# EAGLE board SPU (EAGLE 9.6.2), part 1 of 3
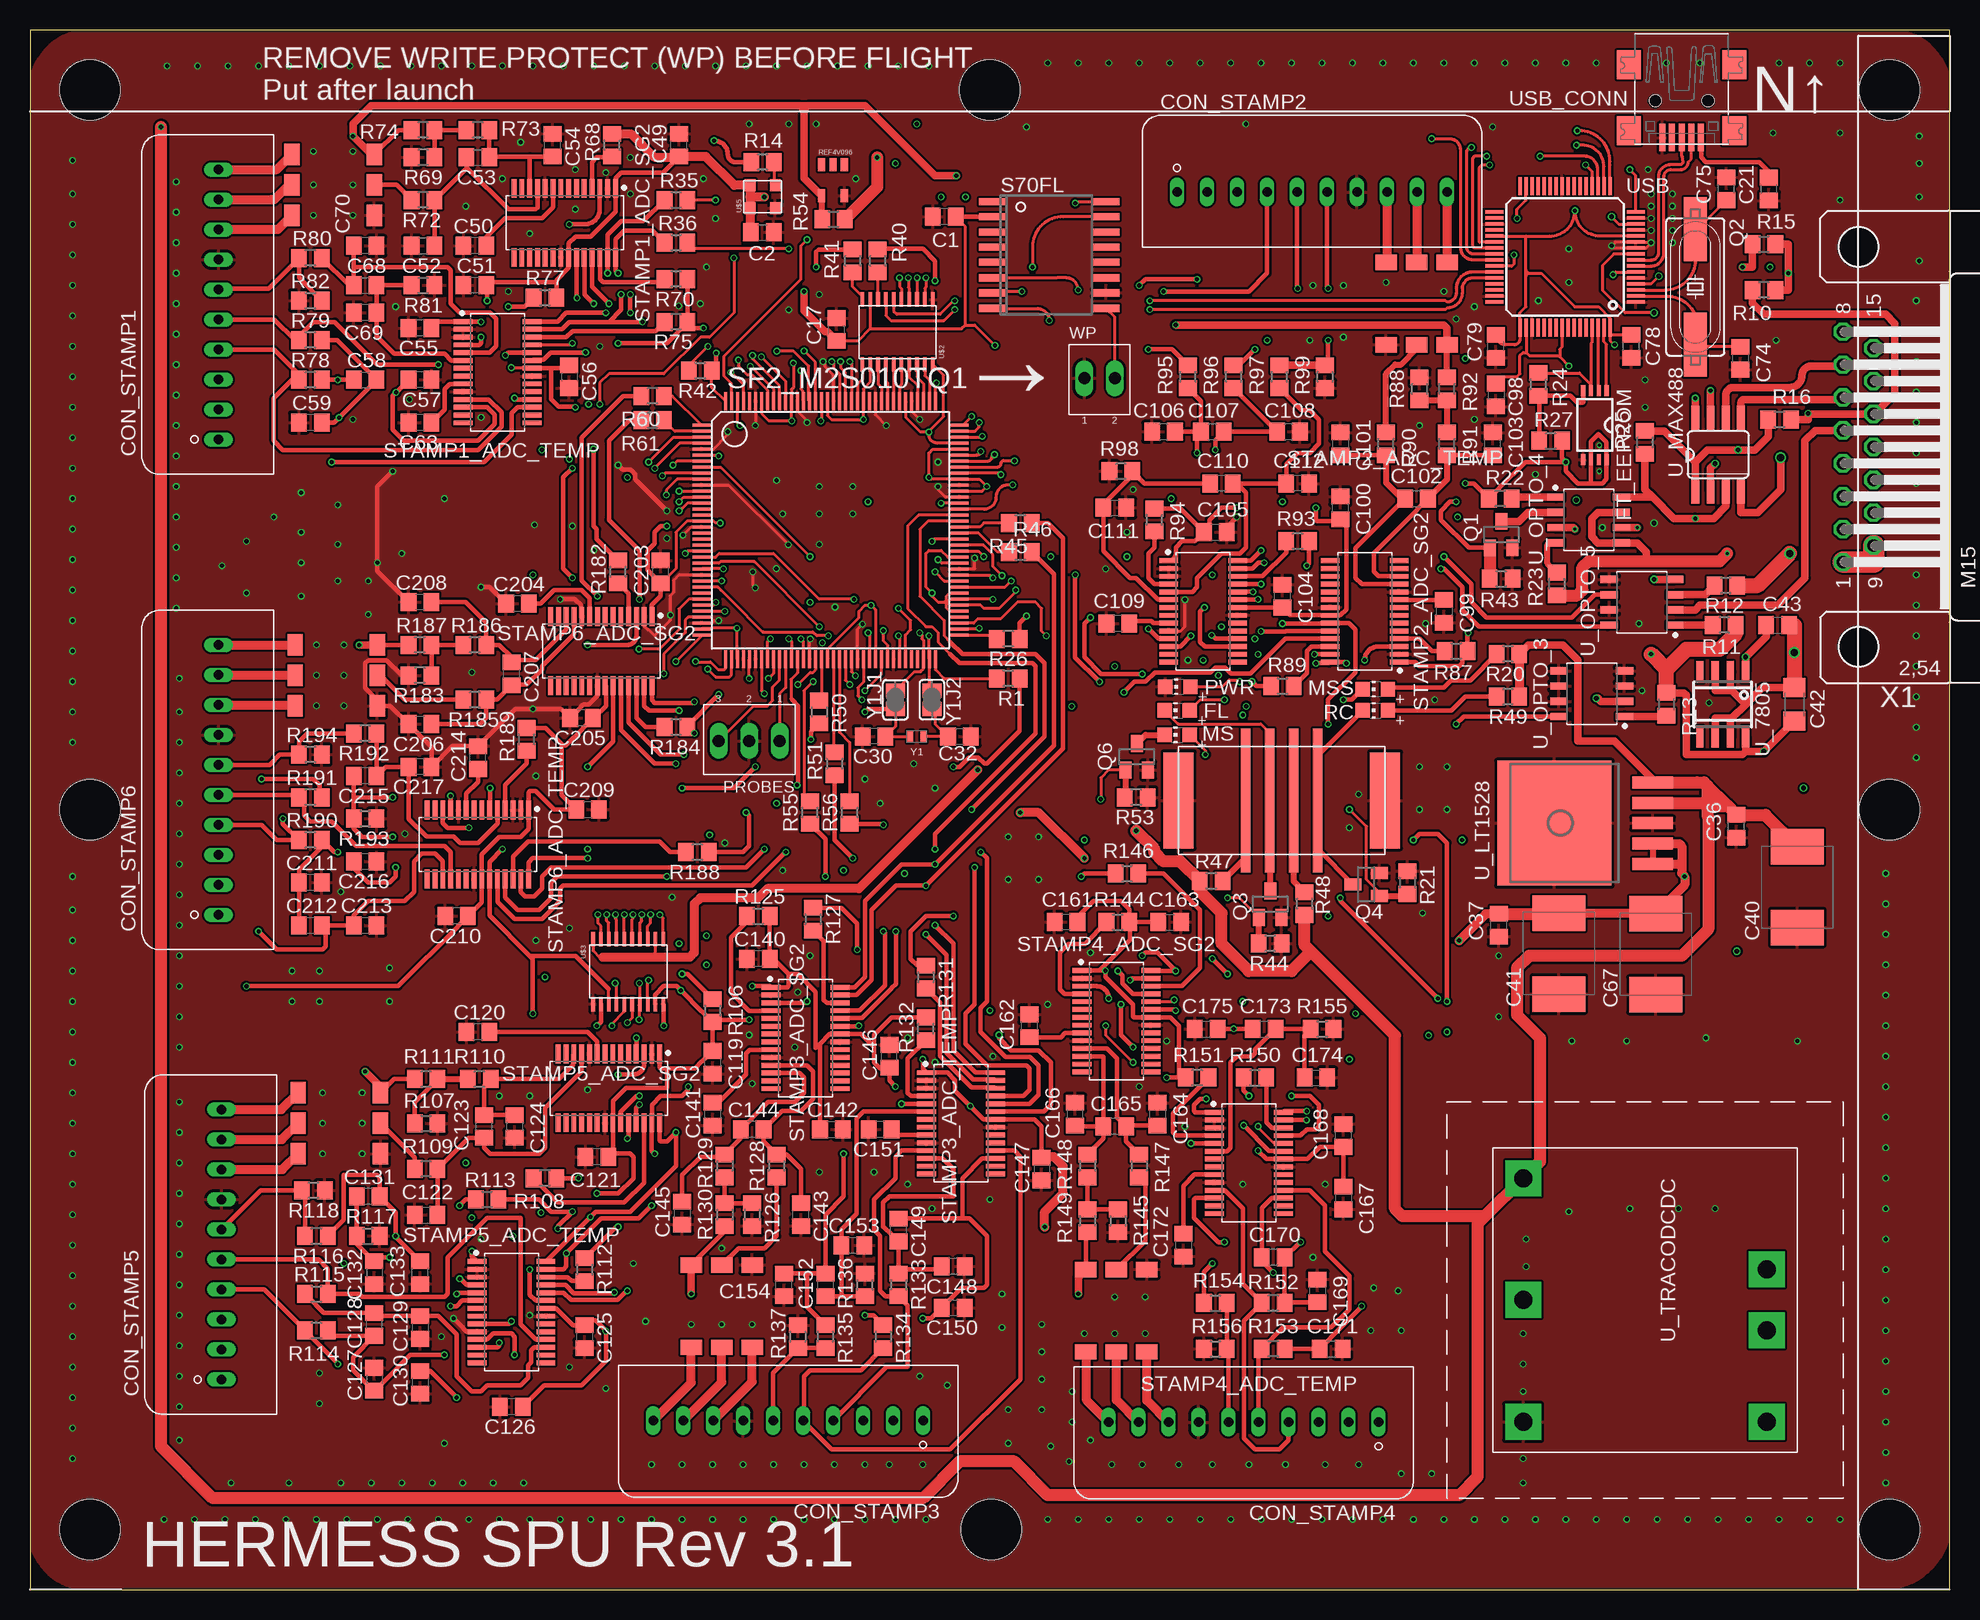
[diagram p8: board, top side]
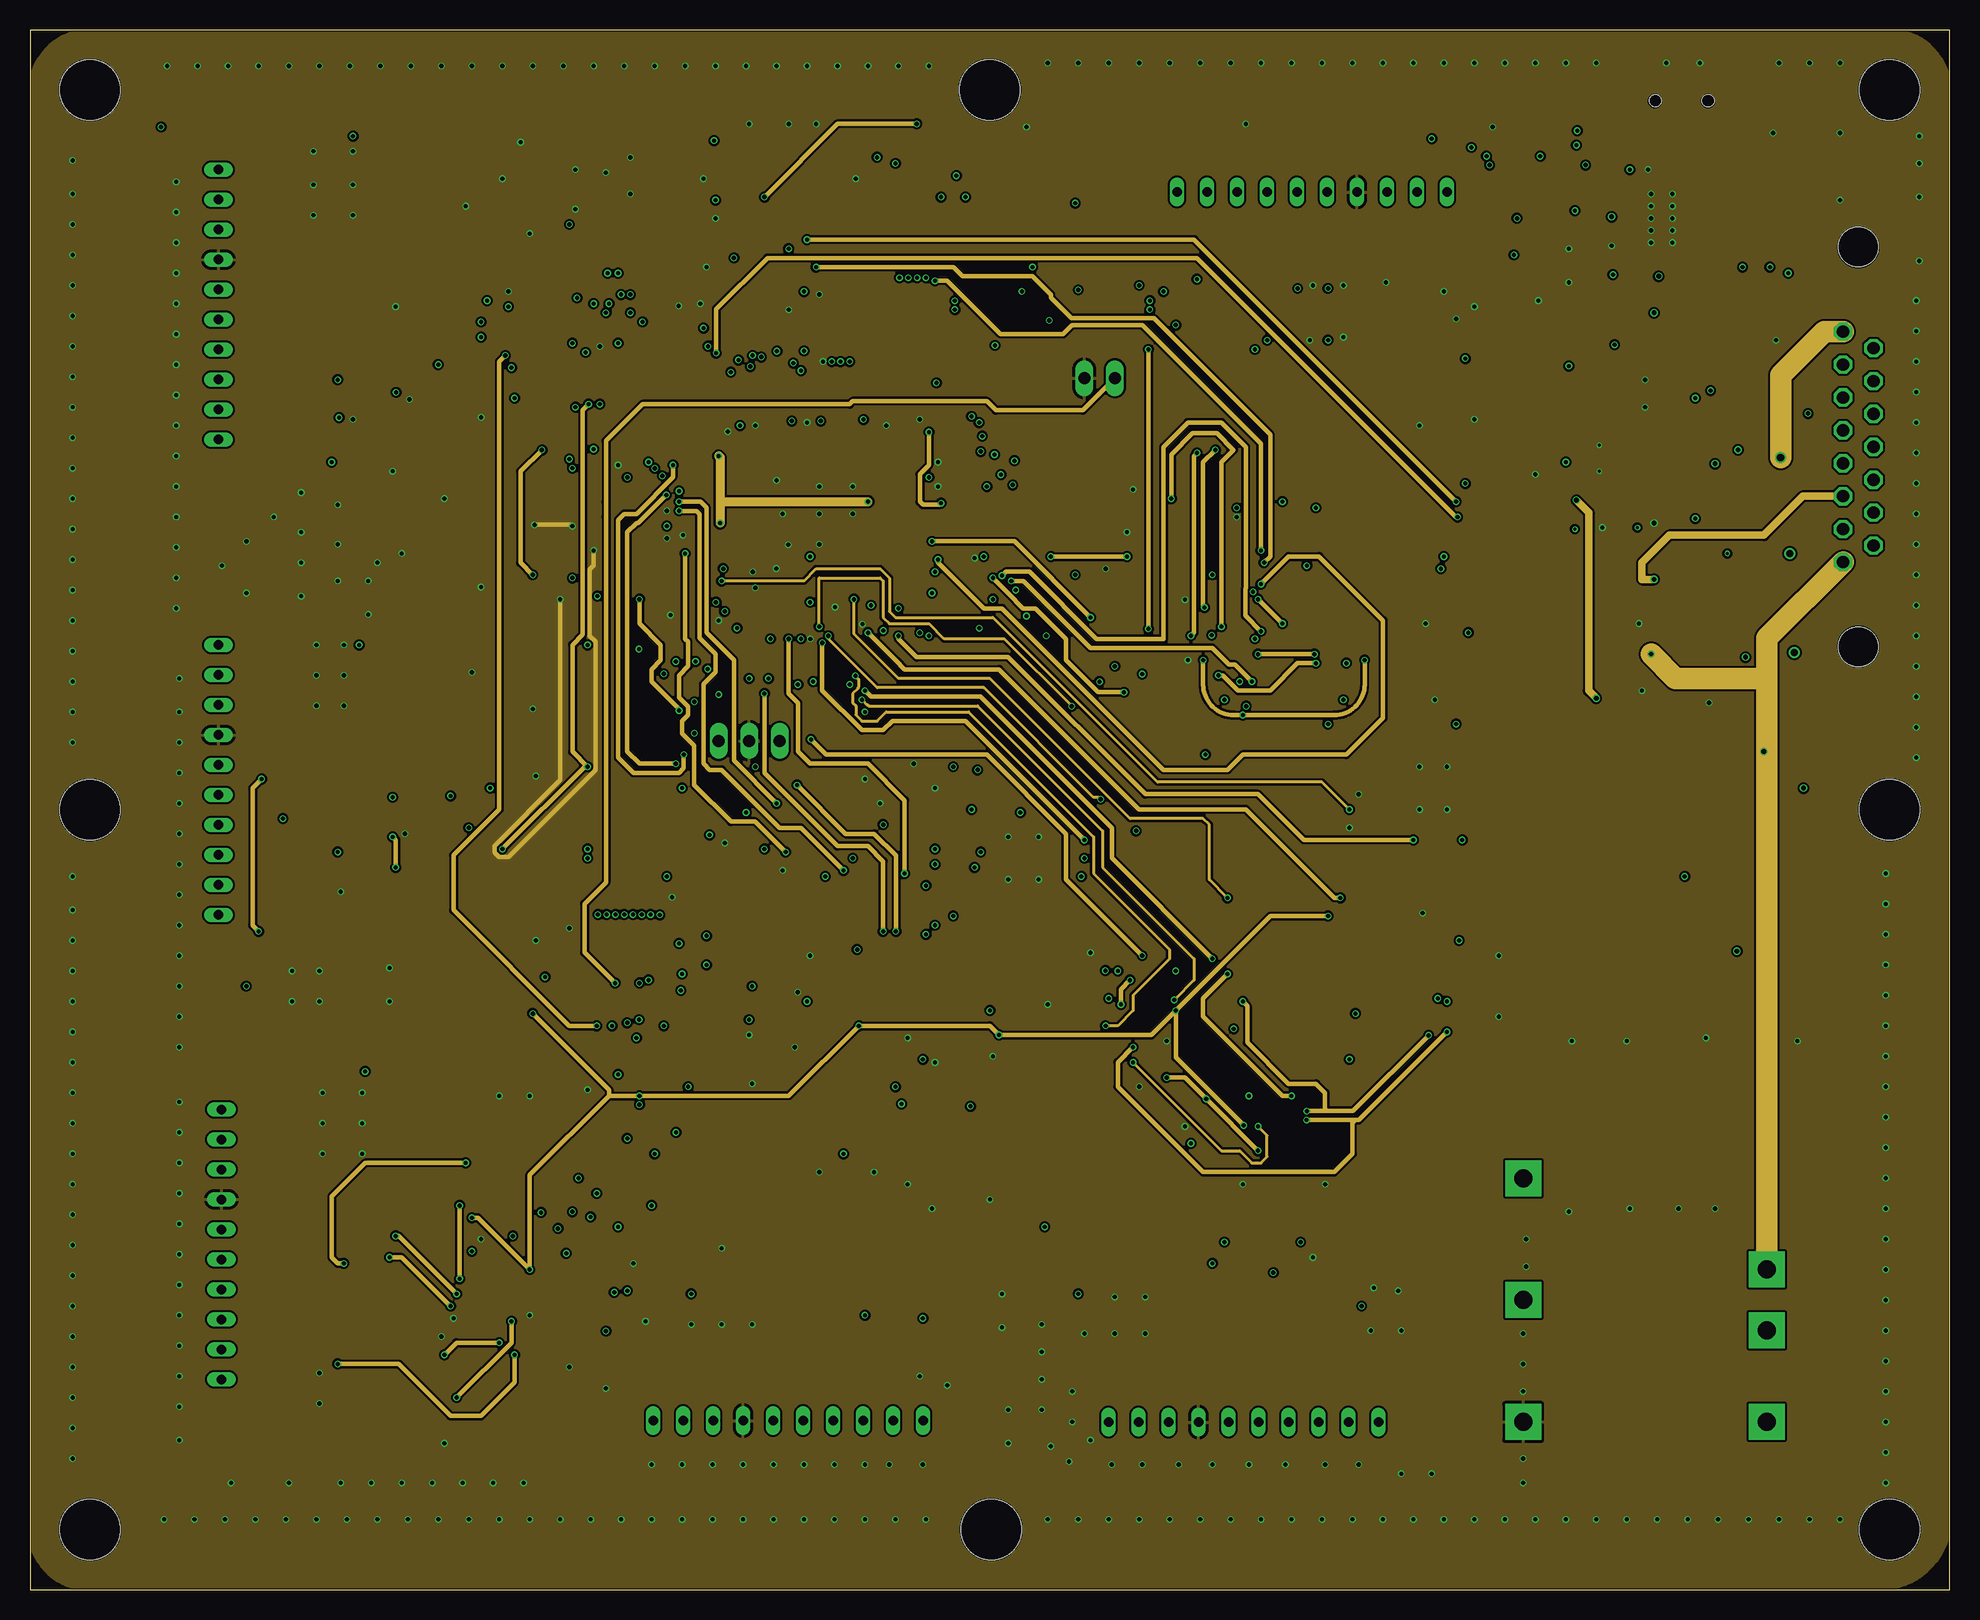
[diagram p9: board, inner layer Route2]
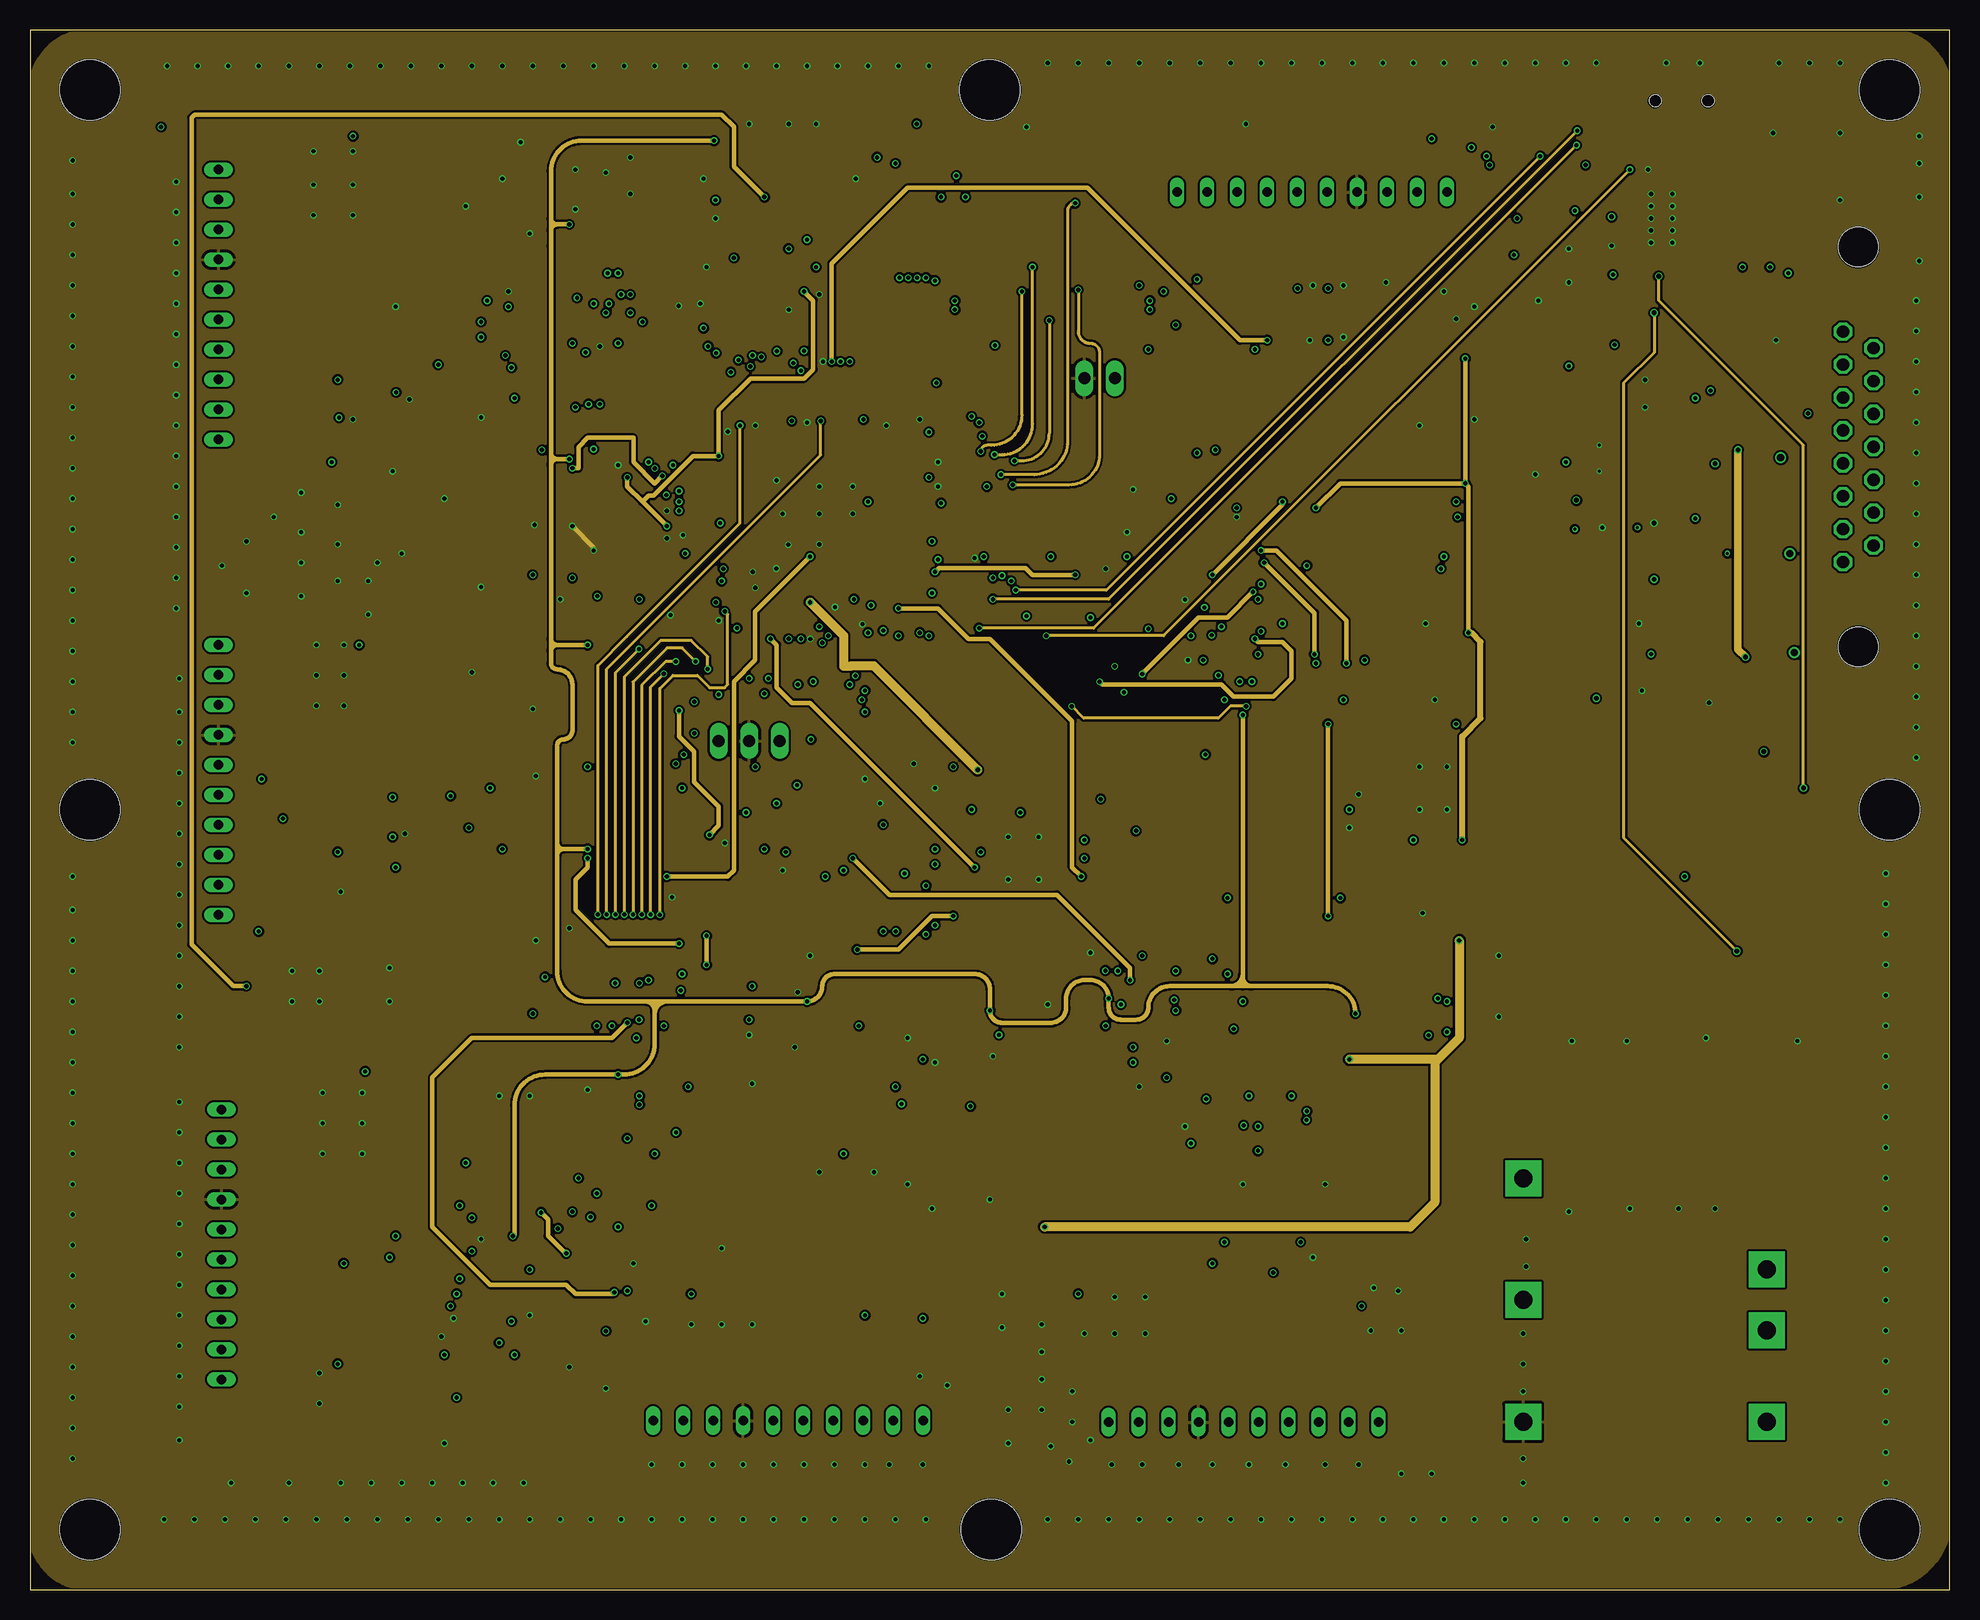
[diagram p10: board, inner layer Route15]
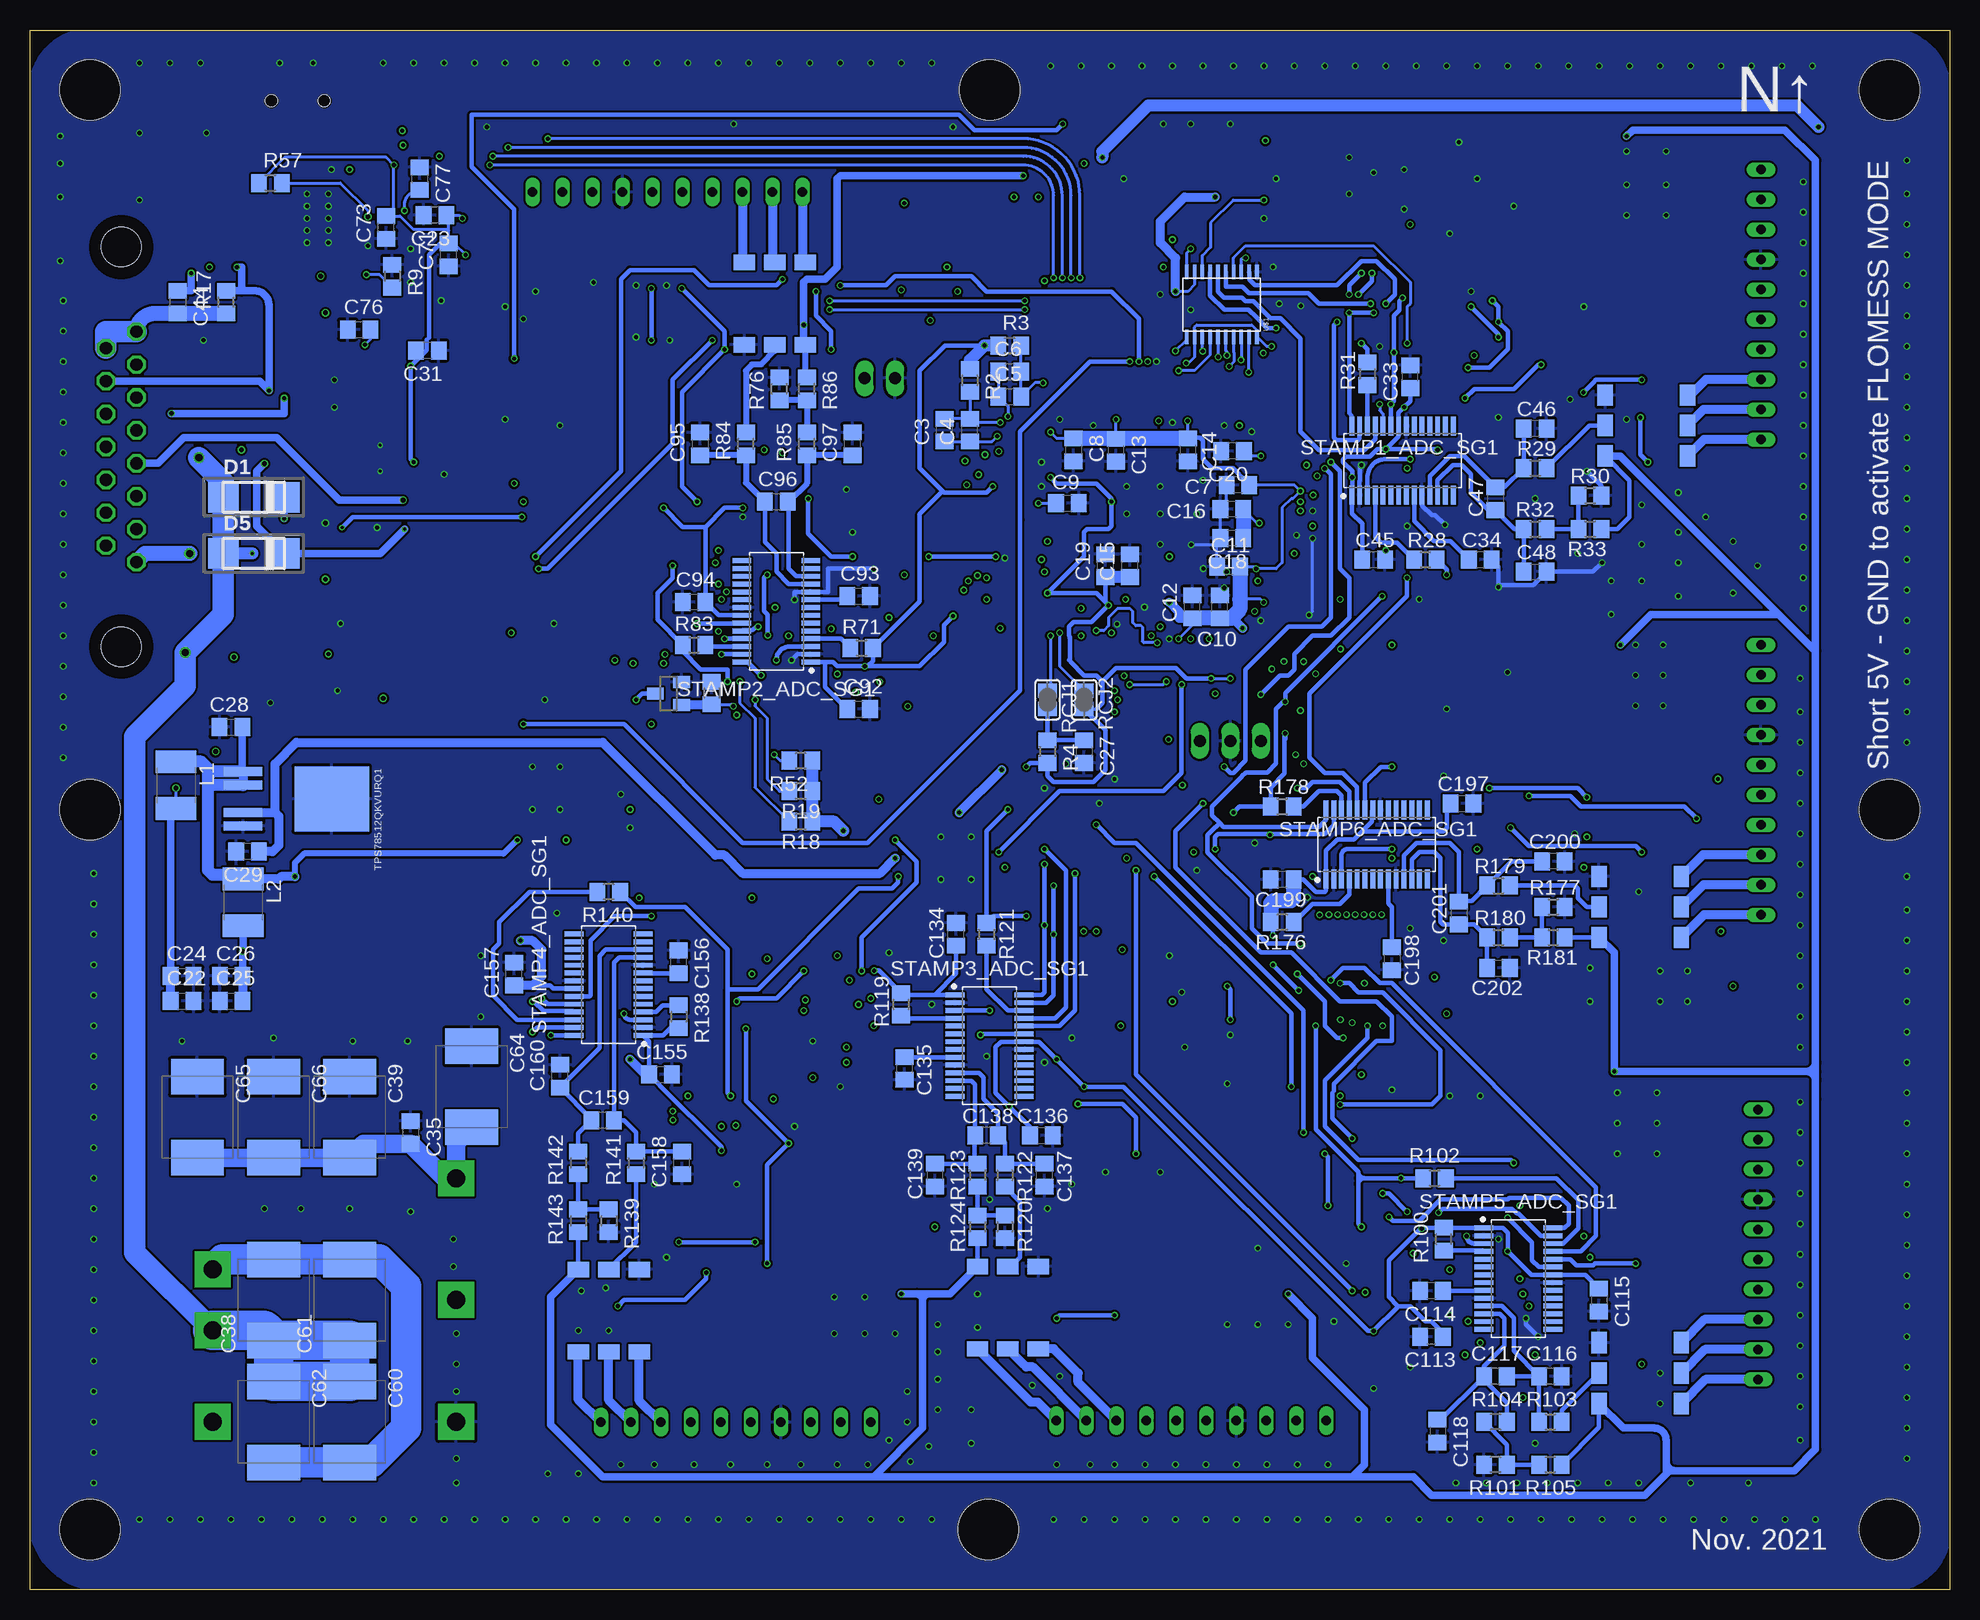
[diagram p11: board, bottom side, seen from below]

Size 160 x 130 mm. Coordinates in mm from the lower left corner, seen from the top.
Outline: 0,0 160,0 160,130 0,130 0,0
Copper layers (1*2*15*16): Top 0.035559375mm / dielectric 0.17018125mm / Route2 0.01778125mm / dielectric 47mil / Route15 0.01778125mm / dielectric 0.17018125mm / Bottom 0.035559375mm
Design rules "jlcpcb-4-layer": minimum track width 5mil, minimum drill 0.2mm, track to track 0.126490625mm, track to pad 0.126490625mm, pad to pad 0.126490625mm, via to via 0.126490625mm, smd to smd 0mil, copper to edge 0.1mm, drill to drill 5mil, minimum pad ring 4mil, minimum via ring 4mil, stop-mask expansion 3mil, vias tented up to drill 100mil, thermal gap 10mil
Net classes: 0 default: width 0.254 mm, drill 0.203 mm, clearance 0.178 mm; 1 28V: width 0.381 mm, drill 0.203 mm, clearance 0.635 mm; 2 5v: width 0.635 mm, drill 0.203 mm, clearance 0.254 mm; 3 28vClearExcept: width 0.635 mm, drill 0.203 mm, clearance 0.508 mm to class 1, clearance 0.178 mm
Holes 5 mm at 5,5 155,5 155,125 5,125 5,65 80,125 155,65 80.13,5

## Footprints (pad centres in the part's own frame; a part is rotated, then mirrored left to right if it is on the bottom)
C0805 = smd 1.3 x 1.5: 1 -0.95,0; 2 0.95,0
E/7260-38W = smd 2.95 x 4.4: + 3.375,0; - -3.375,0
C1206 = smd 1.6 x 1.8: 1 -1.4,0; 2 1.4,0
IL-AG5-10P-S3T2 = drill 0.8 long: P$1 2.9,4.6; P$2 5.4,4.6; P$3 7.9,4.6; P$4 10.4,4.6; P$5 12.9,4.6; P$6 15.4,4.6; P$7 17.9,4.6; P$8 20.4,4.6; P$9 22.9,4.6; P$10 25.4,4.6
DMELF = smd 2.54 x 2.54: A -2.54,0; C 2.54,0
CHIP-LED0805 = smd 1.2 x 1.2: A 0,-1.05; C 0,1.05
TSSOP-8 = smd 0.9 x 0.35: 1 -2.875,0.975; 2 -2.875,0.325; 3 -2.875,-0.325; 4 -2.875,-0.975; 5 2.875,-0.975; 6 2.875,-0.325; 7 2.875,0.325; 8 2.875,0.975
L1812 = smd 1.9 x 3.4: 1 -1.95,0; 2 1.95,0
PSS254_G3 = drill 1 long: 1 1.27,3.048; 2 3.81,3.048; 3 6.35,3.048
SOT23 = smd 1 x 1.4: 1 -0.95,-1.1; 2 0.95,-1.1; 3 0,1.1
HC49UP = smd 5.334 x 1.93: 1 -4.826,0; 2 4.826,0
R0805 = smd 1.3 x 1.5: 1 -0.95,0; 2 0.95,0
SJ = smd 1.168 x 1.6: 1 -0.762,0; 2 0.762,0
SOT-23 = smd 1.1 x 0.6: P1 -1,1; P2 -1,0.05; P3 -1,-0.9; P4 1.6,-0.9; P5 1.6,1
SOIC16 = smd 0.6 x 2.2: 1 -4.445,-5.14; 2 -3.175,-5.14; 3 -1.905,-5.14; 4 -0.635,-5.14; 5 0.615,-5.14; 6 1.915,-5.14; 7 3.165,-5.14; 8 4.465,-5.14; 9 4.465,4.36; 10 3.165,4.36; 11 1.915,4.36; 12 0.615,4.36; 13 -0.635,4.36; 14 -1.89,4.355; 15 -3.185,4.36; 16 -4.435,4.36
TQFP144 = smd 1.5 x 0.27: 1 -10.75,8.75; 2 -10.75,8.25; 3 -10.75,7.75; 4 -10.75,7.25; 5 -10.75,6.75; 6 -10.75,6.25; 7 -10.75,5.75; 8 -10.75,5.25; 9 -10.75,4.75; 10 -10.75,4.25; 11 -10.75,3.75; 12 -10.75,3.25; 13 -10.75,2.75; 14 -10.75,2.25; 15 -10.75,1.75; 16 -10.75,1.25; 17 -10.75,0.75; 18 -10.75,0.25; 19 -10.75,-0.25; 20 -10.75,-0.75; 21 -10.75,-1.25; 22 -10.75,-1.75; 23 -10.75,-2.25; 24 -10.75,-2.75; 25 -10.75,-3.25; 26 -10.75,-3.75; 27 -10.75,-4.25; 28 -10.75,-4.75; 29 -10.75,-5.25; 30 -10.75,-5.75; 31 -10.75,-6.25; 32 -10.75,-6.75; 33 -10.75,-7.25; 34 -10.75,-7.75; 35 -10.75,-8.25; 36 -10.75,-8.75; 73 10.75,-8.75; 74 10.75,-8.25; 75 10.75,-7.75; 76 10.75,-7.25; 77 10.75,-6.75; 78 10.75,-6.25; 79 10.75,-5.75; 80 10.75,-5.25; 81 10.75,-4.75; 82 10.75,-4.25; 83 10.75,-3.75; 84 10.75,-3.25; 85 10.75,-2.75; 86 10.75,-2.25; 87 10.75,-1.75; 88 10.75,-1.25; 89 10.75,-0.75; 90 10.75,-0.25; 91 10.75,0.25; 92 10.75,0.75; 93 10.75,1.25; 94 10.75,1.75; 95 10.75,2.25; 96 10.75,2.75; 97 10.75,3.25; 98 10.75,3.75; 99 10.75,4.25; 100 10.75,4.75; 101 10.75,5.25; 102 10.75,5.75; 103 10.75,6.25; 104 10.75,6.75; 105 10.75,7.25; 106 10.75,7.75; 107 10.75,8.25; 108 10.75,8.75 | smd 0.27 x 1.5: 37 -8.75,-10.75; 38 -8.25,-10.75; 39 -7.75,-10.75; 40 -7.25,-10.75; 41 -6.75,-10.75; 42 -6.25,-10.75; 43 -5.75,-10.75; 44 -5.25,-10.75; 45 -4.75,-10.75; 46 -4.25,-10.75; 47 -3.75,-10.75; 48 -3.25,-10.75; 49 -2.75,-10.75; 50 -2.25,-10.75; 51 -1.75,-10.75; 52 -1.25,-10.75; 53 -0.75,-10.75; 54 -0.25,-10.75; 55 0.25,-10.75; 56 0.75,-10.75; 57 1.25,-10.75; 58 1.75,-10.75; 59 2.25,-10.75; 60 2.75,-10.75; 61 3.25,-10.75; 62 3.75,-10.75; 63 4.25,-10.75; 64 4.75,-10.75; 65 5.25,-10.75; 66 5.75,-10.75; 67 6.25,-10.75; 68 6.75,-10.75; 69 7.25,-10.75; 70 7.75,-10.75; 71 8.25,-10.75; 72 8.75,-10.75; 109 8.75,10.75; 110 8.25,10.75; 111 7.75,10.75; 112 7.25,10.75; 113 6.75,10.75; 114 6.25,10.75; 115 5.75,10.75; 116 5.25,10.75; 117 4.75,10.75; 118 4.25,10.75; 119 3.75,10.75; 120 3.25,10.75; 121 2.75,10.75; 122 2.25,10.75; 123 1.75,10.75; 124 1.25,10.75; 125 0.75,10.75; 126 0.25,10.75; 127 -0.25,10.75; 128 -0.75,10.75; 129 -1.25,10.75; 130 -1.75,10.75; 131 -2.25,10.75; 132 -2.75,10.75; 133 -3.25,10.75; 134 -3.75,10.75; 135 -4.25,10.75; 136 -4.75,10.75; 137 -5.25,10.75; 138 -5.75,10.75; 139 -6.25,10.75; 140 -6.75,10.75; 141 -7.25,10.75; 142 -7.75,10.75; 143 -8.25,10.75; 144 -8.75,10.75
TSSOP28 = smd 1.572 x 0.407: 1 -2.872,4.225; 2 -2.872,3.575; 3 -2.872,2.925; 4 -2.872,2.275; 5 -2.872,1.625; 6 -2.872,0.975; 7 -2.872,0.325; 8 -2.872,-0.325; 9 -2.872,-0.975; 10 -2.872,-1.625; 11 -2.872,-2.275; 12 -2.872,-2.925; 13 -2.872,-3.575; 14 -2.872,-4.225; 15 2.872,-4.225; 16 2.872,-3.575; 17 2.872,-2.925; 18 2.872,-2.275; 19 2.872,-1.625; 20 2.872,-0.975; 21 2.872,-0.325; 22 2.872,0.325; 23 2.872,0.975; 24 2.872,1.625; 25 2.872,2.275; 26 2.872,2.925; 27 2.872,3.575; 28 2.872,4.225
TO-252-5 = smd 0.75 x 3.2: 1 -2.28,0; 2 -1.14,0; 3 1.14,0; 4 2.28,0 | smd 5.4 x 6.2: 5 0,7.4
TSSOP-20 = smd 1.2 x 0.3: P1 -2,3; P2 -2,2.35; P3 -2,1.7; P4 -2,1.05; P5 -2,0.4; P6 -2,-0.25; P7 -2,-0.9; P8 -2,-1.55; P9 -2,-2.2; P10 -2,-2.85; P11 3.4,-2.85; P12 3.4,-2.2; P13 3.4,-1.55; P14 3.4,-0.9; P15 3.4,-0.25; P16 3.4,0.4; P17 3.4,1.05; P18 3.4,1.7; P19 3.4,2.35; P20 3.4,3
CDFN3225 = smd 1 x 0.9: P1 1,3; P2 1,0.9; P3 2.9,0.9; P4 2.9,3
COMMON_MODE_CHOKE = smd 1.27 x 1.78: P$1 0,5.08; P$2 6.86,5.08; P$3 0,2.54; P$4 6.86,2.54; P$5 0,0; P$6 6.86,0
SOIC8 = smd 0.6 x 1.8: 1 -1.905,-2.7; 2 -0.635,-2.7; 3 0.635,-2.7; 4 1.905,-2.7; 5 1.905,2.7; 6 0.635,2.7; 7 -0.635,2.7; 8 -1.905,2.7
Q5-DD = smd 1 x 3.4: 1 -3.4,-7.875; 2 -1.7,-7.875; 3 0,-7.875; 4 1.7,-7.875; 5 3.4,-7.875 | smd 10.414 x 9.525: 6 0,0.325
SO08 = smd 0.66 x 2.032: 1 -1.905,-3.073; 2 -0.635,-3.073; 3 0.635,-3.073; 4 1.905,-3.073; 5 1.905,3.073; 6 0.635,3.073; 7 -0.635,3.073; 8 -1.905,3.073
SOIC127P594X363-8N = smd 1.44 x 0.614: 1 -2.731,1.905; 2 -2.731,0.635; 3 -2.731,-0.635; 4 -2.731,-1.905; 5 2.731,-1.905; 6 2.731,-0.635; 7 2.731,0.635; 8 2.731,1.905
THL_20WI_SERIES = drill 1.5 pad 3 square: 1 -2.54,10.16; 2 2.54,10.16; 3 -10.16,-10.16; 4 0,-10.16; 5 10.16,-10.16; 6 10.16,10.16
LQFP64 = smd 1.5 x 0.3: 1 -5.702,3.3; 2 -5.702,2.8; 3 -5.702,2.3; 4 -5.702,1.8; 5 -5.702,1.3; 6 -5.702,0.8; 7 -5.702,0.3; 8 -5.702,-0.2; 9 -5.702,-0.7; 10 -5.702,-1.2; 11 -5.702,-1.7; 12 -5.702,-2.2; 13 -5.702,-2.7; 14 -5.702,-3.2; 15 -5.702,-3.7; 16 -5.702,-4.2; 33 6.098,-4.2; 34 6.098,-3.7; 35 6.098,-3.2; 36 6.098,-2.7; 37 6.098,-2.2; 38 6.098,-1.7; 39 6.098,-1.2; 40 6.098,-0.7; 41 6.098,-0.2; 42 6.098,0.3; 43 6.098,0.8; 44 6.098,1.3; 45 6.098,1.8; 46 6.098,2.3; 47 6.098,2.8; 48 6.098,3.3 | smd 0.3 x 1.5: 17 -3.552,-6.35; 18 -3.052,-6.35; 19 -2.552,-6.35; 20 -2.052,-6.35; 21 -1.552,-6.35; 22 -1.052,-6.35; 23 -0.552,-6.35; 24 -0.052,-6.35; 25 0.448,-6.35; 26 0.948,-6.35; 27 1.448,-6.35; 28 1.948,-6.35; 29 2.448,-6.35; 30 2.948,-6.35; 31 3.448,-6.35; 32 3.948,-6.35; 49 3.948,5.45; 50 3.448,5.45; 51 2.948,5.45; 52 2.448,5.45; 53 1.948,5.45; 54 1.448,5.45; 55 0.948,5.45; 56 0.448,5.45; 57 -0.052,5.45; 58 -0.552,5.45; 59 -1.052,5.45; 60 -1.552,5.45; 61 -2.052,5.45; 62 -2.552,5.45; 63 -3.052,5.45; 64 -3.552,5.45
USB-MINIB = smd 0.5 x 2.308: D+ 0,4.064; D- -0.8,4.064; GND 1.6,4.064; ID 0.8,4.064; VBUS -1.6,4.064 | smd 2 x 2.4: GND1 -4.4,-2; GND2 -4.4,3.5; GND3 4.4,3.5; GND4 4.4,-2 | hole 1: -2.2,1; 2.2,1
PSS254_G2 = drill 1 long: 1 1.27,3.048; 2 3.81,3.048
M15H = drill 1.016 octagon: 1 -9.601,1.27; 2 -6.858,1.27; 3 -4.115,1.27; 4 -1.372,1.27; 5 1.372,1.27; 6 4.115,1.27; 7 6.858,1.27; 8 9.601,1.27; 9 -8.23,-1.27; 10 -5.486,-1.27; 11 -2.743,-1.27; 12 0,-1.27; 13 2.743,-1.27; 14 5.486,-1.27; 15 8.23,-1.27 | hole 3.302: 16.662,0; -16.662,0
WE-XTAL_IQXC-90 = smd 0.5 x 1: 1 -0.55,0; 2 0.55,0
ZE05H-4P-2V = smd 0.8 x 12: P1 -3,0; P2 -1,0; P3 1,0; P4 3,0 | smd 2.5 x 8: P5 -8.61,0; P6 8.61,0

## Placement (x,y rotation side)
C1  100n  [C0805]  76.2,114.43 180 top
C2  10n  [C0805]  61.04,113.13 0 top
C3  4u7  [C0805]  83.77,96.65 90 bottom
C4  470n  [C0805]  81.66,96.65 90 bottom
C5  4u7  [C0805]  78.33,99.44 0 bottom
C6  470n  [C0805]  78.33,101.52 0 bottom
C7  100n  [C0805]  59.31,92.08 180 bottom
C8  100n  [C0805]  73.03,95 270 bottom
C9  100n  [C0805]  73.53,90.55 0 bottom
C10  100n  [C0805]  60.83,81.92 90 bottom
C11  100n  [C0805]  60.1,85.27 180 bottom
C12  100n  [C0805]  63.12,81.92 90 bottom
C13  100n  [C0805]  69.49,94.97 270 bottom
C14  100n  [C0805]  63.5,95 270 bottom
C15  100n  [C0805]  68.33,85.34 90 bottom
C16  100n  [C0805]  59.82,90.04 180 bottom
C17  100n  [C0805]  67.23,105.03 90 top
C18  100n  [C0805]  59.82,87.63 180 bottom
C19  100n  [C0805]  70.36,85.34 90 bottom
C20  100n  [C0805]  59.77,94.89 180 bottom
C21  100n  [C0805]  144.96,116.74 90 top
C22  100n  [C0805]  147.32,49.07 0 bottom
C23  100n  [C0805]  126.24,114.55 180 bottom
C24  4u7  [C0805]  147.32,51.13 0 bottom
C25  100n  [C0805]  143.23,49.07 0 bottom
C26  4u7  [C0805]  143.23,51.13 0 bottom
C27  150n  [C0805]  72.14,69.85 270 bottom
C28  100n  [C0805]  143.26,71.88 0 bottom
C29  100n  [C0805]  141.86,61.52 180 bottom
C30  6pF  [C0805]  70.36,71.12 180 top
C31  100n  [C0805]  126.87,103.28 180 bottom
C32  6pF  [C0805]  77.47,71.12 0 top
C33  100n  [C0805]  44.96,101.09 90 bottom
C34  1u  [C0805]  39.12,85.85 0 bottom
C35  100n  [C0805]  128.27,38.1 270 bottom
C36  100n  [C0805]  142.24,63.63 90 top
C37  100n  [C0805]  122.43,55.37 90 top
C38  10u  [E/7260-38W]  139.7,24.13 90 bottom
C39  10u  [E/7260-38W]  133.35,39.37 270 bottom
C40  10u  [E/7260-38W]  147.32,58.55 90 top
C41  10u  [E/7260-38W]  127.43,53.01 90 top
C42  100n  [C1206]  147.07,73.79 270 top
C43  100n  [C0805]  145.67,80.39 0 top
C44  ~0  [C0805]  147.7,107.31 270 bottom
C45  100n  [C0805]  48.01,85.85 0 bottom
C46  100n  [C0805]  34.54,96.77 180 bottom
C47  100n  [C0805]  37.85,90.93 270 bottom
C48  100n  [C0805]  34.54,84.84 0 bottom
C49  100n  [C0805]  54.1,120.4 90 top
C50  1u  [C0805]  37.08,112.01 180 top
C51  100n  [C0805]  37.08,108.71 180 top
C52  100n  [C0805]  32.77,112.01 0 top
C53  100n  [C0805]  37.34,119.38 0 top
C54  100n  [C0805]  43.56,120.4 90 top
C55  100n  [C0805]  32.51,105.16 180 top
C56  100n  [C0805]  44.96,101.09 270 top
C57  6n8  [C0805]  32.51,100.84 180 top
C58  68n  [C0805]  27.94,100.84 0 top
C59  6n8  [C0805]  23.37,97.28 180 top
C60  10u  [E/7260-38W]  133.35,13.97 270 bottom
C61  10u  [E/7260-38W]  133.35,24.13 90 bottom
C62  10u  [E/7260-38W]  139.7,13.97 270 bottom
C63  1u  [C0805]  32.51,97.28 180 top
C64  10u  [E/7260-38W]  123.19,41.91 270 bottom
C65  10u  [E/7260-38W]  146.05,39.37 270 bottom
C66  10u  [E/7260-38W]  139.7,39.37 270 bottom
C67  10u  [E/7260-38W]  135.51,52.96 90 top
C68  33n  [C0805]  27.94,108.71 0 top
C69  3n3  [C0805]  27.94,106.43 180 top
C70  3n3  [C0805]  27.94,112.01 180 top
C71  100n  [C0805]  125.09,111.25 90 bottom
C73  100n  [C0805]  130.3,113.54 90 bottom
C74  22p  [C0805]  142.57,102.64 270 top
C75  22p  [C0805]  141.4,116.76 90 top
C76  100n  [C0805]  132.56,105.03 0 bottom
C77  100n  [C0805]  127.51,117.6 270 bottom
C78  100n  [C0805]  133.48,103.63 90 top
C79  4u7  [C0805]  122.17,103.63 90 top
C92  100n  [C0805]  90.93,73.41 0 bottom
C93  1u  [C0805]  90.93,82.8 0 bottom
C94  100n  [C0805]  104.65,82.3 180 bottom
C95  100n  [C0805]  104.14,95.5 270 bottom
C96  100n  [C0805]  97.79,90.68 0 bottom
C97  100n  [C0805]  91.44,95.5 90 bottom
C98  100n  [C0805]  122.17,99.57 270 top
C99  1u  [C0805]  117.86,81.53 270 top
C100  100n  [C0805]  109.22,90.17 90 top
C101  100n  [C0805]  109.22,95.5 270 top
C102  100n  [C0805]  115.57,90.93 0 top
C103  100n  [C0805]  121.92,95.5 90 top
C104  100n  [C0805]  104.39,82.8 90 top
C105  100n  [C0805]  98.81,88.14 0 top
C106  6n8  [C0805]  94.49,96.52 0 top
C107  68n  [C0805]  98.55,96.52 0 top
C108  6n8  [C0805]  104.9,96.52 0 top
C109  1u  [C0805]  90.68,80.52 180 top
C110  33n  [C0805]  99.31,92.2 180 top
C111  3n3  [C0805]  90.42,90.17 0 top
C112  3n3  [C0805]  105.66,92.2 180 top
C113  100n  [C0805]  43.18,21.08 180 bottom
C114  1u  [C0805]  43.18,24.89 180 bottom
C115  100n  [C0805]  29.21,24.13 270 bottom
C116  100n  [C0805]  33.27,17.78 180 bottom
C117  100n  [C0805]  37.85,17.78 180 bottom
C118  100n  [C0805]  42.67,13.21 270 bottom
C119  100n  [C0805]  56.9,43.94 270 top
C120  1u  [C0805]  37.34,46.48 180 top
C121  100n  [C0805]  47.24,36.07 180 top
C122  100n  [C0805]  33.02,31.24 0 top
C123  100n  [C0805]  37.85,38.61 90 top
C124  100n  [C0805]  40.39,38.61 270 top
C125  100n  [C0805]  46.23,21.08 270 top
C126  100n  [C0805]  40.13,15.24 180 top
C127  6n8  [C0805]  28.7,17.53 270 top
C128  68n  [C0805]  28.7,22.1 90 top
C129  6n8  [C0805]  32.51,21.84 270 top
C130  1u  [C0805]  32.51,17.27 270 top
C131  33n  [C0805]  28.19,32.77 180 top
C132  3n3  [C0805]  28.7,26.42 270 top
C133  3n3  [C0805]  32.51,26.42 90 top
C134  100n  [C0805]  82.8,54.61 90 bottom
C135  1u  [C0805]  87.12,43.43 270 bottom
C136  100n  [C0805]  75.69,37.85 0 bottom
C137  100n  [C0805]  75.44,34.54 90 bottom
C138  100n  [C0805]  80.26,37.85 180 bottom
C139  100n  [C0805]  84.58,34.54 270 bottom
C140  100n  [C0805]  60.71,52.58 180 top
C141  1u  [C0805]  56.9,39.62 270 top
C142  100n  [C0805]  66.8,38.35 0 top
C143  100n  [C0805]  64.26,31.24 90 top
C144  100n  [C0805]  60.2,38.35 180 top
C145  100n  [C0805]  54.36,31.37 270 top
C146  100n  [C0805]  71.63,44.45 90 top
C147  100n  [C0805]  84.33,35.05 270 top
C148  6n8  [C0805]  76.96,26.92 180 top
C149  68n  [C0805]  72.39,29.97 90 top
C150  6n8  [C0805]  76.96,23.5 0 top
C151  1u  [C0805]  70.87,38.35 180 top
C152  33n  [C0805]  66.29,25.4 270 top
C153  3n3  [C0805]  68.58,28.7 0 top
C154  3n3  [C0805]  62.87,25.4 90 top
C155  100n  [C0805]  107.44,42.93 0 bottom
C156  1u  [C0805]  105.92,52.32 90 bottom
C157  100n  [C0805]  119.63,51.31 90 bottom
C158  100n  [C0805]  105.66,35.56 90 bottom
C159  100n  [C0805]  112.27,39.12 180 bottom
C160  100n  [C0805]  115.82,42.8 90 bottom
C161  100n  [C0805]  86.36,55.63 180 top
C162  1u  [C0805]  83.31,46.99 90 top
C163  100n  [C0805]  95,55.63 0 top
C164  100n  [C0805]  93.98,39.62 270 top
C165  100n  [C0805]  90.42,38.61 180 top
C166  100n  [C0805]  87.12,39.62 90 top
C167  100n  [C0805]  109.47,32.64 270 top
C168  100n  [C0805]  109.47,37.85 90 top
C169  6n8  [C0805]  107.31,24.89 270 top
C170  68n  [C0805]  103.63,27.69 180 top
C171  6n8  [C0805]  108.46,20.07 0 top
C172  1u  [C0805]  96.14,28.7 270 top
C173  33n  [C0805]  102.87,46.74 0 top
C174  3n3  [C0805]  107.19,42.67 0 top
C175  3n3  [C0805]  98.04,46.74 0 top
C197  100n  [C0805]  40.64,65.53 0 bottom
C198  1u  [C0805]  46.48,52.58 270 bottom
C199  100n  [C0805]  55.63,59.18 180 bottom
C200  100n  [C0805]  33.02,60.71 180 bottom
C201  100n  [C0805]  40.89,56.39 270 bottom
C202  100n  [C0805]  37.59,51.82 0 bottom
C203  100n  [C0805]  52.58,84.84 90 top
C204  1u  [C0805]  40.64,82.17 180 top
C205  100n  [C0805]  45.97,72.64 180 top
C206  100n  [C0805]  32.51,72.14 0 top
C207  100n  [C0805]  40.13,76.33 90 top
C208  100n  [C0805]  32.51,82.3 180 top
C209  100n  [C0805]  46.48,65.02 0 top
C210  100n  [C0805]  35.56,56.13 180 top
C211  6n8  [C0805]  23.37,58.93 180 top
C212  68n  [C0805]  23.37,55.37 0 top
C213  6n8  [C0805]  27.94,55.37 0 top
C214  1u  [C0805]  37.34,69.34 90 top
C215  33n  [C0805]  27.94,67.82 180 top
C216  3n3  [C0805]  27.94,60.71 0 top
C217  3n3  [C0805]  32.51,68.58 180 top
CON_STAMP1  IL-AG5-10P-S3T2  [IL-AG5-10P-S3T2]  20.32,92.96 90 top
CON_STAMP2  IL-AG5-10P-S3T2  [IL-AG5-10P-S3T2]  92.71,111.89 0 top
CON_STAMP3  IL-AG5-10P-S3T2  [IL-AG5-10P-S3T2]  77.34,18.67 180 top
CON_STAMP4  IL-AG5-10P-S3T2  [IL-AG5-10P-S3T2]  115.32,18.54 180 top
CON_STAMP5  IL-AG5-10P-S3T2  [IL-AG5-10P-S3T2]  20.57,14.61 90 top
CON_STAMP6  IL-AG5-10P-S3T2  [IL-AG5-10P-S3T2]  20.32,53.34 90 top
D1  5V6  [DMELF]  141.35,91.06 0 bottom
D5  5V6  [DMELF]  141.35,86.36 0 bottom
FL  1V9  [CHIP-LED0805]  95.63,73.28 90 top
FT_EEPROM  M93C46-WDW6TP  [TSSOP-8]  130.44,97.07 270 top
L1  [L1812]  147.83,67.06 270 bottom
L2  [L1812]  142.24,57.28 270 bottom
MS  1V9  [CHIP-LED0805]  95.63,71.25 90 top
MSS  1V9  [CHIP-LED0805]  112.14,75.06 90 top
PROBES  [PSS254_G3]  63.75,73.79 180 top
PWR  1V9  [CHIP-LED0805]  95.68,75.26 90 top
Q1  BSS123  [SOT23]  122.63,87.93 0 top
Q2  12MHz  [HC49UP]  138.81,108.58 270 top
Q3  BSS123  [SOT23]  103.38,57.12 0 top
Q4  BSS123  [SOT23]  111.38,58.78 90 top
Q5  BSS123  [SOT23]  106.78,74.68 90 bottom
Q6  BSS123  [SOT23]  92.25,69.42 0 top
R1  10k  [R0805]  81.53,75.95 180 top
R2  2  [R0805]  81.66,100.79 270 bottom
R3  2  [R0805]  78.33,103.71 0 bottom
R4  2  [R0805]  75.18,69.85 270 bottom
R9  12k  [R0805]  129.79,109.47 270 bottom
R10  500  [R0805]  144.53,108.33 180 top
R11  3k  [R0805]  141.22,80.39 180 top
R12  3k  [R0805]  141.35,83.69 180 top
R13  3k  [R0805]  136.4,73.79 270 top
R14  47  [R0805]  61.06,118.97 180 top
R15  500  [R0805]  144.53,112.14 0 top
R16  3k3  [R0805]  145.83,97.54 0 top
R17  3k3  [R0805]  143.64,107.31 90 bottom
R18  680  [R0805]  95.76,64.01 180 bottom
R19  680  [R0805]  95.76,66.55 180 bottom
R20  680  [R0805]  123.19,77.98 180 top
R21  1k  [R0805]  114.81,58.93 270 top
R22  1k  [R0805]  122.56,90.93 180 top
R23  3k  [R0805]  127.25,83.82 270 top
R24  2k2  [R0805]  125.73,100.46 90 top
R25  7k5  [R0805]  134.62,95.63 90 top
R26  10k  [R0805]  81.53,79.25 180 top
R27  10k  [R0805]  126.75,95.76 0 top
R28  4k7  [R0805]  43.69,85.85 0 bottom
R29  40 1%  [R0805]  34.54,93.47 0 bottom
R30  1k 0.1%  [R0805]  29.97,91.19 0 bottom
R31  47  [R0805]  48.51,101.35 270 bottom
R32  40 1%  [R0805]  34.54,88.39 0 bottom
R33  1k 0.1%  [R0805]  29.97,88.39 0 bottom
R34  1k  [R0805]  103.17,74.73 270 bottom
R35  47  [R0805]  53.85,115.82 0 top
R36  47  [R0805]  53.85,112.27 0 top
R40  47  [R0805]  70.66,110.74 90 top
R41  47  [R0805]  68.58,110.74 90 top
R42  600  [R0805]  55.88,101.6 0 top
R43  1k  [R0805]  122.63,84.25 0 top
R44  1k  [R0805]  103.38,53.85 180 top
R45  47  [R0805]  82.55,88.9 180 top
R46  47  [R0805]  82.55,86.49 0 top
R47  330  [R0805]  98.45,59.08 0 top
R48  330  [R0805]  106.25,57.18 90 top
R49  680  [R0805]  123.19,74.42 180 top
R50  47  [R0805]  65.79,73.15 270 top
R51  47  [R0805]  67.06,68.83 270 top
R52  680  [R0805]  95.76,69.09 180 bottom
R53  1k  [R0805]  92.2,66.04 180 top
R54  3R65  [R0805]  66.98,114.22 0 top
R55  47  [R0805]  65.02,64.77 90 top
R56  47  [R0805]  68.33,64.77 90 top
R57  1k  [R0805]  139.95,117.25 0 bottom
R60  47  [R0805]  51.89,99.49 180 top
R61  47  [R0805]  51.89,97.46 180 top
R68  4k7  [R0805]  48.51,120.4 90 top
R69  1k 0.1%  [R0805]  32.77,119.38 180 top
R70  47  [R0805]  53.85,109.22 180 top
R71  4k7  [R0805]  90.68,78.49 0 bottom
R72  40 1%  [R0805]  32.77,115.82 180 top
R73  40 1%  [R0805]  37.34,121.67 180 top
R74  1k 0.1%  [R0805]  32.77,121.67 180 top
R75  47  [R0805]  53.85,105.66 180 top
R76  1k 0.1%  [R0805]  97.54,100.08 90 bottom
R77  4k7  [R0805]  42.93,107.7 0 top
R78  4k7 1%  [R0805]  23.37,100.84 180 top
R79  4k7 1%  [R0805]  23.37,104.14 180 top
R80  9k09 1%  [R0805]  23.37,111 180 top
R81  9k09 1%  [R0805]  32.77,108.71 0 top
R82  820 0.1%  [R0805]  23.37,107.44 0 top
R83  47  [R0805]  104.65,78.74 0 bottom
R84  40 1%  [R0805]  100.33,95.5 90 bottom
R85  40 1%  [R0805]  95.25,95.5 90 bottom
R86  1k 0.1%  [R0805]  95.25,100.08 90 bottom
R87  4k7  [R0805]  118.87,78.23 0 top
R88  1k 0.1%  [R0805]  115.82,100.08 90 top
R89  47  [R0805]  104.39,75.31 0 top
R90  40 1%  [R0805]  113.03,95.5 90 top
R91  40 1%  [R0805]  118.11,95.5 90 top
R92  1k 0.1%  [R0805]  118.11,100.08 90 top
R93  47  [R0805]  105.66,87.38 180 top
R94  4k7  [R0805]  93.73,89.15 90 top
R95  4k7 1%  [R0805]  96.52,101.09 90 top
R96  4k7 1%  [R0805]  100.33,101.09 90 top
R97  9k09 1%  [R0805]  104.14,101.09 90 top
R98  9k09 1%  [R0805]  90.93,93.22 180 top
R99  820 0.1%  [R0805]  107.95,101.09 90 top
R100  4k7  [R0805]  42.16,29.21 90 bottom
R101  1k 0.1%  [R0805]  37.85,10.41 180 bottom
R102  47  [R0805]  42.93,34.29 0 bottom
R103  40 1%  [R0805]  33.27,13.97 0 bottom
R104  40 1%  [R0805]  37.85,13.97 180 bottom
R105  1k 0.1%  [R0805]  33.27,10.41 0 bottom
R106  4k7  [R0805]  56.9,48.26 270 top
R107  1k 0.1%  [R0805]  33.02,38.86 0 top
R108  47  [R0805]  42.93,34.29 180 top
R109  40 1%  [R0805]  33.02,35.05 180 top
R110  40 1%  [R0805]  37.47,42.55 180 top
R111  1k 0.1%  [R0805]  33.02,42.55 180 top
R112  47  [R0805]  46.23,26.67 270 top
R113  4k7  [R0805]  38.1,32.51 0 top
R114  4k7 1%  [R0805]  23.88,21.59 180 top
R115  4k7 1%  [R0805]  23.88,24.64 0 top
R116  9k09 1%  [R0805]  23.88,29.46 180 top
R117  9k09 1%  [R0805]  28.19,29.46 0 top
R118  820 0.1%  [R0805]  23.62,33.27 180 top
R119  4k7  [R0805]  87.38,48.77 90 bottom
R120  1k 0.1%  [R0805]  78.74,30.23 270 bottom
R121  47  [R0805]  80.26,54.61 270 bottom
R122  40 1%  [R0805]  78.74,34.54 270 bottom
R123  40 1%  [R0805]  81.03,34.54 270 bottom
R124  1k 0.1%  [R0805]  81.03,30.23 270 bottom
R125  4k7  [R0805]  60.71,56.13 0 top
R126  1k 0.1%  [R0805]  60.2,31.24 270 top
R127  47  [R0805]  65.28,55.88 270 top
R128  40 1%  [R0805]  62.23,35.31 270 top
R129  40 1%  [R0805]  57.91,35.31 270 top
R130  1k 0.1%  [R0805]  57.91,31.24 270 top
R131  47  [R0805]  74.68,51.05 270 top
R132  4k7  [R0805]  74.68,46.74 90 top
R133  4k7 1%  [R0805]  72.39,25.4 270 top
R134  4k7 1%  [R0805]  71.12,21.08 270 top
R135  9k09 1%  [R0805]  66.29,21.08 270 top
R136  9k09 1%  [R0805]  69.6,25.4 90 top
R137  820 0.1%  [R0805]  64.01,21.08 270 top
R138  4k7  [R0805]  105.92,47.75 270 bottom
R139  1k 0.1%  [R0805]  111.76,30.73 270 bottom
R140  47  [R0805]  111.76,58.17 180 bottom
R141  40 1%  [R0805]  109.47,35.56 270 bottom
R142  40 1%  [R0805]  114.3,35.56 270 bottom
R143  1k 0.1%  [R0805]  114.3,30.73 270 bottom
R144  4k7  [R0805]  90.68,55.63 0 top
R145  1k 0.1%  [R0805]  90.68,30.73 270 top
R146  47  [R0805]  91.44,59.69 0 top
R147  40 1%  [R0805]  92.46,35.31 270 top
R148  40 1%  [R0805]  88.14,35.31 270 top
R149  1k 0.1%  [R0805]  88.14,30.73 270 top
R150  47  [R0805]  102.11,42.67 0 top
R151  4k7  [R0805]  97.28,42.67 180 top
R152  4k7 1%  [R0805]  103.63,23.88 180 top
R153  4k7 1%  [R0805]  103.63,20.07 180 top
R154  9k09 1%  [R0805]  98.81,23.88 0 top
R155  9k09 1%  [R0805]  107.7,46.74 0 top
R156  820 0.1%  [R0805]  98.81,20.07 0 top
R176  4k7  [R0805]  55.63,55.63 180 bottom
R177  1k 0.1%  [R0805]  33.02,56.9 0 bottom
R178  47  [R0805]  55.63,65.28 0 bottom
R179  40 1%  [R0805]  37.59,58.67 0 bottom
R180  40 1%  [R0805]  37.59,54.36 0 bottom
R181  1k 0.1%  [R0805]  33.02,54.36 0 bottom
R182  4k7  [R0805]  49.02,84.84 90 top
R183  1k 0.1%  [R0805]  32.51,76.2 180 top
R184  47  [R0805]  53.85,71.88 180 top
R185  40 1%  [R0805]  37.08,74.17 180 top
R186  40 1%  [R0805]  37.08,78.74 180 top
R187  1k 0.1%  [R0805]  32.51,78.74 180 top
R188  47  [R0805]  55.63,61.47 180 top
R189  4k7  [R0805]  41.4,70.87 90 top
R190  4k7 1%  [R0805]  23.37,62.48 180 top
R191  4k7 1%  [R0805]  23.37,66.04 180 top
R192  9k09 1%  [R0805]  27.94,71.37 180 top
R193  9k09 1%  [R0805]  27.94,64.26 0 top
R194  820 0.1%  [R0805]  23.37,69.6 180 top
RC  1V9  [CHIP-LED0805]  112.14,73.28 90 top
RCJ1  [SJ]  75.18,74.17 270 bottom
RCJ2  [SJ]  72.14,74.17 270 bottom
REF4V096  LM4030  [SOT-23]  66.88,117.78 270 top
S70FL  S70FL01GSAGM  [SOIC16]  85.34,111.25 270 top
SF2_M2S010TQ1  SF2_M2S010TQ144  [TQFP144]  66.72,88.31 0 top
STAMP1_ADC_SG1  ADS1148QPWRQ1  [TSSOP28]  45.59,94.11 90 bottom
STAMP1_ADC_SG2  ADS1148QPWRQ1  [TSSOP28]  44.58,113.92 270 top
STAMP1_ADC_TEMP  ADS1148QPWRQ1  [TSSOP28]  38.99,101.47 0 top
STAMP2_ADC_SG1  ADS1148QPWRQ1  [TSSOP28]  97.79,81.53 180 bottom
STAMP2_ADC_SG2  ADS1148QPWRQ1  [TSSOP28]  111.25,81.53 180 top
STAMP2_ADC_TEMP  ADS1148QPWRQ1  [TSSOP28]  97.79,81.53 0 top
STAMP3_ADC_SG1  ADS1148QPWRQ1  [TSSOP28]  80.01,45.34 0 bottom
STAMP3_ADC_SG2  ADS1148QPWRQ1  [TSSOP28]  64.64,45.97 0 top
STAMP3_ADC_TEMP  ADS1148QPWRQ1  [TSSOP28]  77.6,38.86 0 top
STAMP4_ADC_SG1  ADS1148QPWRQ1  [TSSOP28]  111.76,50.42 180 bottom
STAMP4_ADC_SG2  ADS1148QPWRQ1  [TSSOP28]  90.55,47.37 0 top
STAMP4_ADC_TEMP  ADS1148QPWRQ1  [TSSOP28]  101.6,35.56 0 top
STAMP5_ADC_SG1  ADS1148QPWRQ1  [TSSOP28]  35.94,25.91 0 bottom
STAMP5_ADC_SG2  ADS1148QPWRQ1  [TSSOP28]  48.26,41.78 270 top
STAMP5_ADC_TEMP  ADS1148QPWRQ1  [TSSOP28]  40.13,23.11 0 top
STAMP6_ADC_SG1  ADS1148QPWRQ1  [TSSOP28]  47.75,62.1 90 bottom
STAMP6_ADC_SG2  ADS1148QPWRQ1  [TSSOP28]  47.62,78.23 270 top
STAMP6_ADC_TEMP  ADS1148QPWRQ1  [TSSOP28]  37.34,62.1 270 top
TPS78512QKVURQ1  TPS785  [TO-252-5]  142.24,65.91 270 bottom
U$1  NXB0108PWJ  [TSSOP-20]  60.58,106.43 90 bottom
U$2  NXB0108PWJ  [TSSOP-20]  72.39,104.14 90 top
U$3  NXB0108PWJ  [TSSOP-20]  49.78,52.2 270 top
U$5  DSC1001CI1-004.0960T  [CDFN3225]  63.02,114.15 90 top
U$6  COMMON_MODE_CHOKE  [COMMON_MODE_CHOKE]  28.7,94.49 0 bottom
U$7  COMMON_MODE_CHOKE  [COMMON_MODE_CHOKE]  28.7,119.63 180 top
U$9  COMMON_MODE_CHOKE  [COMMON_MODE_CHOKE]  95.38,103.76 90 bottom
U$10  COMMON_MODE_CHOKE  [COMMON_MODE_CHOKE]  118.11,103.76 90 top
U$11  COMMON_MODE_CHOKE  [COMMON_MODE_CHOKE]  29.21,15.49 0 bottom
U$12  COMMON_MODE_CHOKE  [COMMON_MODE_CHOKE]  29.21,41.4 180 top
U$13  COMMON_MODE_CHOKE  [COMMON_MODE_CHOKE]  81.03,26.92 270 bottom
U$14  COMMON_MODE_CHOKE  [COMMON_MODE_CHOKE]  55.12,27.05 270 top
U$15  COMMON_MODE_CHOKE  [COMMON_MODE_CHOKE]  114.3,26.67 270 bottom
U$16  COMMON_MODE_CHOKE  [COMMON_MODE_CHOKE]  88.01,26.67 270 top
U$19  COMMON_MODE_CHOKE  [COMMON_MODE_CHOKE]  29.21,54.36 0 bottom
U$20  COMMON_MODE_CHOKE  [COMMON_MODE_CHOKE]  28.96,78.74 180 top
U_7805  LM78L05ACMX/NOPB  [SOIC8]  141.1,73.79 180 top
U_LT1528  LT1528  [Q5-DD]  127.38,63.88 90 top
U_MAX488  MAX488CSA  [SO08]  140.72,94.61 0 top
U_OPTO_3  MOCD207M  [SOIC127P594X363-8N]  130.18,74.68 180 top
U_OPTO_4  MOCD207M  [SOIC127P594X363-8N]  129.92,89.15 0 top
U_OPTO_5  MOCD207M  [SOIC127P594X363-8N]  134.37,82.3 180 top
U_TRACODCDC  THN10-2411WIR  [THL_20WI_SERIES]  134.62,24.13 270 top
USB  FT2232HL  [LQFP64]  128.14,110.62 180 top
USB_CONN  [USB-MINIB]  137.67,125.09 180 top
WP  [PSS254_G2]  86.61,97.92 0 top
X1  [M15H]  152.4,95.25 90 top
Y1  32.768kHz  [WE-XTAL_IQXC-90]  73.91,71.12 0 top
Y1J1  [SJ]  72.14,74.17 270 top
Y1J2  [SJ]  75.18,74.17 90 top
ZE05H-4P-2V  ZE05-4P-2V  [ZE05H-4P-2V]  104.34,65.79 180 top

## Tracks (layer width: path | path; a pad name or v marks a point on that pad's centre or on a via)
1V2  (via drill 0.35)
  Top 0.254: U$2.P2 70.04,100.65 69.47,100.08 SF2_M2S010TQ1.121 v69.47,97.54 66.8,97.54 66.47,97.87 SF2_M2S010TQ1.127 | SF2_M2S010TQ1.114 73.03,99 73.03,97.68 74.22,96.48 v74.93,96.48 | v63.63,102.23 63.63,100.2 63.47,100.05 SF2_M2S010TQ1.133 63.47,97.44 v63.5,97.41 61.59,97.41 60.98,98.03 SF2_M2S010TQ1.138 | v56.52,103.63 54.93,102.05 R42.1 | U$3.P10 46.93,53.27 47.5,52.7 47.75,52.7 51.69,52.7 52.13,53.15 U$3.P2 | U$2.P10 76.16,101.22 76.16,97.79 74.93,96.56 v74.93,96.48 | SF2_M2S010TQ1.39 58.93,77.6 v58.93,80.14 56.86,80.14 56.85,80.12 56.03,80.12 SF2_M2S010TQ1.35 | v64.26,79.25 64.45,79.06 64.45,77.58 SF2_M2S010TQ1.50 | SF2_M2S010TQ1.105 75.64,95.56 arc-90 74.93,96.27 v74.93,96.48 | v54.1,91.57 SF2_M2S010TQ1.12 | v57.78,85.09 56,85.09 SF2_M2S010TQ1.25 | SF2_M2S010TQ1.95 v75.95,90.55 | SF2_M2S010TQ1.31 56.94,82.06 v57.17,82.3
  Top 0.762: v87.88,60.96 84.07,64.77 v82.55,64.77 | v78.99,68.33 69.09,58.42 61.47,58.42 60.71,57.66 55.88,57.66 55.37,57.15 55.37,53.09 54.99,52.7 47.75,52.7
  Route2 0.381: v74.93,96.48 74.93,93.73 74.17,92.96 74.17,90.68 74.42,90.42 75.82,90.42 v75.95,90.55
  Route15 0.762: v65.02,82.3 67.82,79.5 67.82,76.96 68.42,76.96 68.46,77 70.31,77 v78.99,68.33
  Bottom 0.254: v63.63,102.23 63.43,102.23 62.93,102.74 U$1.P2 62.93,105.22 62.74,105.41 58.17,105.41 57.73,104.97 U$1.P10 56.94,103.63 v56.52,103.63 | v58.93,80.14 59.82,81.03 | 62.99,80.97 C12.1 63.12,80.39 v64.26,79.25 | C14.1 63.5,96.01 v63.5,97.41 | C13.1 69.49,97.51 v69.47,97.54 | C8.1 73.06,95.98 73.06,95.97 74.42,95.97 v74.93,96.48 | C7.1 54.61,92.08 v54.1,91.57 54.74,90.93 54.86,90.93 55.63,90.17 55.63,85.6 56.13,85.09 v57.78,85.09 57.96,85.27 C11.1 | v75.95,90.55 C9.1 | v57.17,82.3 57.43,82.55 59.15,82.55
  Bottom 0.381: C7.1 59.24,92.96 59.24,92.98 59.73,93.47 61.47,93.47 62.23,94.23 62.23,95.76 62.48,96.01 63.5,96.01
  Bottom 0.762: TPS78512QKVURQ1.3 139.58,64.77 | 139.58,64.77 139.57,64.77 139.26,64.45 139.26,62.04 139.78,61.52 C29.1 | 59.88,80.97 59.76,80.97 v58.93,80.14 | 139.58,64.77 139.58,68.83 137.79,70.61 112.27,70.61 102.87,61.21 102.11,61.21 100.58,59.69 89.15,59.69 v87.88,60.96 | v82.55,64.77 v78.99,68.33 | v65.02,82.3 64.26,81.53 64.26,81.03 64.2,80.97 C12.1
  Bottom 1.27: C11.1 59.15,82.55 59.15,81.7 59.82,81.03 59.88,80.97 C10.1 62.99,80.97 | C14.1 69.47,95.95 C13.1 73,95.92 73.06,95.98
3V3  (via drill 0.35)
  Top 0.254: v129.67,118.75 130.19,118.22 USB.20 | v57.53,88.9 57.15,88.9 56.99,89.06 SF2_M2S010TQ1.17 54.77,89.06 53.85,88.14 53.85,85.09 52.64,83.89 C203.1 | USB.56 127.69,103.56 127.51,103.38 127.51,102.87 | 127.51,102.87 127.51,102.75 v128.27,101.99 | USB.50 124.71,105.15 124.71,103.12 | 124.71,103.12 124.97,102.87 127.51,102.87 | C98.1 122.75,101.09 123.95,101.09 124.21,101.35 124.21,102.87 124.46,103.12 124.71,103.12 | v123.7,111.25 123.7,110.49 123.52,110.31 USB.42 | v123.95,114.3 123.95,115.06 124.69,115.81 USB.31 | SF2_M2S010TQ1.45 61.97,76.36 v61.55,75.95 | v59.94,75.95 59.94,77.53 SF2_M2S010TQ1.41 | SF2_M2S010TQ1.6 57.33,94.56 v57.4,94.49 | SF2_M2S010TQ1.97 79.37,91.56 v79.76,91.95 79.14,92.56 SF2_M2S010TQ1.99 75.08,92.56 v74.93,92.71 74.93,94.74 75.25,95.06 SF2_M2S010TQ1.104 | U$2.P19 70.04,105.09 | C17.1 69.03,104.08 70.04,105.09 | 70.04,105.09 77.66,105.09 77.98,105.41 | 77.98,105.41 77.98,113.6 C1.1 | 77.98,105.41 78.74,105.41 v80.44,103.71 | 76.42,82.08 76.42,81.8 76.65,81.56 SF2_M2S010TQ1.77 | 76.42,82.08 76.42,82.3 | 76.42,82.3 76.42,82.51 | 76.42,82.51 76.42,82.82 76.65,83.06 SF2_M2S010TQ1.80 | SF2_M2S010TQ1.86 76.5,86.06 75.95,86.61 74.93,86.61 74.68,86.36 74.68,83.57 v75.18,83.06 75.18,82.8 75.69,82.3 76.2,82.3 | SF2_M2S010TQ1.54 66.53,77.62 66.53,78.44 69.1,81.01 69.09,81.03 69.09,81.53 69.6,82.04 v70.1,82.04 70.47,81.68 SF2_M2S010TQ1.62 | 41.91,101.85 STAMP1_ADC_TEMP.22 40.19,101.8 v40.13,101.85 | 76.42,82.3 76.2,82.3 | 76.2,82.3 arc90 76.42,82.51 | 76.2,82.3 arc-90 76.42,82.08
  Top 0.381: C100.1 109.38,89.06 | 109.38,89.06 109.73,88.71 109.73,81.7 109.24,81.21 STAMP2_ADC_SG2.22 105.04,81.21 C104.1 STAMP2_ADC_TEMP.22 | STAMP2_ADC_SG2.1 115.48,77.31 115.82,76.96 119.13,76.96 119.38,77.22 119.38,77.79 R87.2 119.82,79.69 v119.89,79.76 | v128.02,93.98 127.7,94.3 R27.2 | v128.02,93.98 128.02,93.22 129.03,92.2 130.05,92.2 | 130.05,92.2 131.06,92.2 131.41,92.55 FT_EEPROM.8 131.41,95.67 130.75,96.33 130.11,95.69 FT_EEPROM.6 130.11,92.26 130.05,92.2 | v128.02,93.98 124.63,93.98 122.49,91.83 122.49,91.81 R22.2 120.33,92.2 v119.63,92.2 | C163.1 91.69,55.63 | 91.69,55.63 R144.2 91.63,56.71 90.93,57.4 88.65,57.4 87.31,56.07 C161.1 | 89.15,51.59 87.69,51.59 STAMP4_ADC_SG2.1 | 89.15,51.59 91.69,54.13 91.69,55.63 | 89.15,51.59 v89.64,51.59 89.64,51.08 91.95,48.77 91.95,47.75 92,47.7 STAMP4_ADC_SG2.22 95.05,47.7 95.76,46.99 95.76,42.67 | C167.1 C168.1 107.51,36.9 106.5,35.88 STAMP4_ADC_TEMP.22 103.05,35.88 v102.36,36.58 | v98.04,40.89 97.54,40.89 97.03,40.39 97.03,39.88 97.12,39.78 STAMP4_ADC_TEMP.1 | v94.74,42.67 95.76,42.67 | 95.76,42.67 R151.2 | STAMP5_ADC_SG2.1 52.48,43.59 arc90 52.65,43.43 53.09,43.43 | R106.2 C119.1 56.01,44.01 55.99,44.01 55.42,43.43 53.09,43.43 | R106.2 56.01,48.19 55.99,48.19 v54.25,49.93 53.89,50.29 52.83,50.29 52.12,49.58 U$3.P19 | 48.48,36.35 48.59,36.46 STAMP5_ADC_SG2.22 48.59,40.71 49.67,41.79 53.09,41.79 53.09,43.43 | 48.48,36.35 C121.1 | STAMP5_ADC_TEMP.1 36.83,27.77 v36.83,28.19 | C126.1 42.86,17.02 45.97,17.02 48.01,19.05 v48.01,21.55 47.13,22.42 46.62,22.42 C125.1 45.28,22.03 43.87,23.44 STAMP5_ADC_TEMP.22 | R113.2 42.42,32.51 43.43,31.5 v45.21,31.5 44.01,30.29 v44.01,30.09
  Top 0.381: 48.48,36.35 50.01,36.35 50.29,36.07 50.29,34.29 49.02,33.02 v47.24,33.02 | C142.1 65.85,45.5 | 65.85,45.5 65.5,45.14 65.5,49.82 64.01,51.31 63.25,51.31 | 65.85,45.5 66.65,46.3 STAMP3_ADC_SG2.22 69.27,46.3 70.36,45.21 | 63.25,51.31 61.98,52.58 C140.1 R125.2 | 63.25,51.31 63.25,50.29 63.15,50.2 STAMP3_ADC_SG2.1 61.68,50.29 v60.2,50.29 | 79.19,39.48 | 79.19,39.48 v78.38,40.28 77.11,41.55 77.11,42.44 76.46,43.09 STAMP3_ADC_TEMP.1 74.42,43.39 v74.42,44.2 | 79.19,39.48 79.48,39.19 STAMP3_ADC_TEMP.22 83.75,39.19 84.33,38.61 84.33,36.07 C147.1 | C146.1 71.63,43.43 | 71.63,43.43 71.63,42.42 v72.14,41.91 | STAMP6_ADC_SG2.22 48.01,75.3 48.01,73.66 46.99,72.64 C205.1 46.04,71.76 46.04,71.74 44.66,70.36 44.45,70.36 44.32,70.48 | STAMP6_ADC_SG2.1 51.82,81.14 51.82,82.04 52.58,82.8 C203.1 51.7,84.77 51.67,84.77 51.46,84.98 51.46,86.59 52.07,87.2 52.07,88.14 52.58,88.65 v53.09,88.65 | C49.1 54.07,119.41 52.77,118.11 49.28,118.11 48.8,117.64 STAMP1_ADC_SG2.1 48.8,114.84 46.74,112.78 45.47,112.78 44.9,112.21 STAMP1_ADC_SG2.22 44.9,110.18 43.88,109.15 | 43.88,109.15 43.69,108.97 38.29,108.97 C51.1 38.1,108.65 v38.1,107.44 | C55.1 34,105.7 STAMP1_ADC_TEMP.1 37.56,105.7 v37.59,105.66 | v45.47,98.55 45.4,98.62 44.05,98.62 43.43,99.24 43.43,101.8 | C1.1 S70FL.2 | R77.2 43.88,109.15 | R106.2 57.08,47.5 v59.94,47.5 | 70.36,45.21 70.36,43.94 70.87,43.43 71.63,43.43 | 70.36,45.21 70.36,46.23 71.82,47.69 R132.2 | R182.2 47.24,87.56 47.24,88.39 46.99,88.65 46.99,95.05 v46.97,95.06 | v107.19,90.17 107.19,89.15 107.28,89.06 109.38,89.06 | R94.2 95.89,90.1 C105.1 | R1.1 82.48,71.56 79.76,68.83 79.55,68.83 79.02,69.36 78.25,69.36 77.47,68.58 v76.96,68.58
  Top 0.381: R26.1 82.48,80.57 v83.06,81.14 | R189.2 42.99,71.82 44.32,70.48 | 44.32,70.48 44.32,66.23 C209.1 43.69,65.02 42.16,66.55 41.66,66.55 41.56,66.45 STAMP6_ADC_TEMP.1 41.56,63.41 40.89,62.74 39.12,62.74 37.66,61.28 STAMP6_ADC_TEMP.22 37.66,57.29 C210.1 35.63,55.25 35.63,55.23 30.69,50.29 v18.03,50.29 | C105.1 97.09,87.38 96.01,87.38 95.5,86.87 95.5,86.34 | 95.5,86.34 95.5,85.76 STAMP2_ADC_TEMP.1 arc90 95.5,86.34 | C105.1 98.3,88.58 98.3,89.15 99.31,90.17 v100.58,90.17 | STAMP1_ADC_TEMP.22 43.43,101.8 | C56.1 44.71,101.8 43.43,101.8
  Top 0.508: C2.1 60.02,113.2 60.02,113.54 60.02,115.32 60.02,116.08 U$5.P4 | U_LT1528.2 U_LT1528.1
  Top 0.635: C17.1 66.48,104.83 66.28,104.83 64.52,106.6 v64.52,108.2
  Top 0.762: v61.21,116.08 60.02,116.08 | 60.02,115.32 U$5.P4 58.72,117.05 56.32,119.45 C49.1 | U$5.P1 60.02,113.54 | C37.2 121.35,56.32 v119.13,54.1 | v84.58,30.23 84.58,31.5 86.11,33.02 86.11,35.31 85.34,36.07 84.33,36.07 | U_LT1528.2 137.46,62.18 137.67,61.98 137.67,60.45 | 137.67,60.45 135.89,60.45 | 137.67,60.45 137.67,59.69 v137.92,59.44 137.92,58.75 C67.+ 135.46,56.38 C41.+ | R68.2 50.1,121.35 52.04,119.41 54.07,119.41
  Top 1.016: C37.2 127.37,56.32 C41.+ | C41.+ 128.78,56.38 128.83,56.33 | 127.48,56.33 C41.+
  Route2 0.381: v102.36,36.58 v98.04,40.89 96.27,42.67 v94.74,42.67 | v42.67,95 40.89,93.22 40.89,85.6 v41.91,84.58 | v73.91,122.17 67.31,122.17 v61.21,116.08
  Route2 0.762: v57.4,94.49 57.53,94.36 57.53,90.68 | 57.53,90.68 v57.53,88.9 | 57.53,90.68 v69.85,90.68
  Route15 0.381: v119.63,92.2 109.22,92.2 v107.19,90.17 | v56.39,52.07 v56.39,54.49 | v119.89,79.76 119.89,91.95 v119.63,92.2 | v53.09,88.65 51.05,90.68 | 51.05,90.68 49.78,91.95 v49.78,92.71 | 51.05,90.68 51.56,91.19 51.97,91.19 55.27,94.49 v57.4,94.49 57.4,98.3 60.06,100.95 64.53,100.95 65.28,101.7 65.28,107.44 v64.52,108.2 | v61.21,116.08 58.67,118.62 58.67,121.92 57.66,122.94 13.72,122.94 13.46,122.68 13.46,53.78 16.95,50.29 v18.03,50.29 | v119.63,92.2 v119.63,102.62
  Route15 0.508: v119.38,62.48 119.38,71.12 120.9,72.64 120.9,78.99 120.14,79.76 v119.89,79.76
  Route15 0.762: v119.13,54.1 119.13,45.97 117.35,44.2 | 117.35,44.2 v109.98,44.2 | 117.35,44.2 117.09,43.94 117.09,32.26 115.06,30.23 v84.58,30.23
  Bottom 0.254: C16.1 57.72,88.9 v57.53,88.9 | v128.27,101.99 127.82,102.44 C31.2 | v123.7,111.25 124.65,112.2 C71.2 125.09,113.28 | 125.09,113.28 125.09,114.36 C23.1 124.21,114.55 v123.95,114.3 | 125.09,113.28 125.21,113.4 128.06,113.4 129.15,114.49 C73.2 129.67,115.12 v129.67,118.75 130.3,119.38 138.77,119.38 R57.1 | v61.55,75.95 v59.94,75.95 | 71.63,73.41 71.12,73.41 | 73.28,77.34 73.41,77.47 73.41,79.31 73.31,79.41 | v57.4,94.49 58.41,94.49 C20.1 | U$1.P19 62.93,108.78 63.5,108.2 v64.52,108.2 | C197.1 41.91,65.21 41.91,65.02
  Bottom 0.381: STAMP2_ADC_SG1.22 102.61,81.21 C94.1 103.7,88.58 | 93.73,77.31 93.06,77.31 92.71,76.96 v90.42,76.96 | 93.73,77.31 STAMP2_ADC_SG1.1 | v100.58,90.17 102.11,90.17 103.7,88.58 | v128.02,93.98 128.27,94.23 v128.27,101.99 126.94,103.32 126.94,104.18 126.75,104.37 126.75,111.25 125.8,112.2 C71.2 | R138.2 106.61,46.8 107.22,46.19 STAMP4_ADC_SG1.1 108.39,45.7 C155.1 107.51,42.04 107.51,42.02 102.36,36.88 v102.36,36.58 | 119.38,50.36 C157.1 | 118.11,50.36 116.65,50.36 116.38,50.09 STAMP4_ADC_SG1.22 | C92.1 93.73,75.25 93.73,77.31 | C115.1 30.36,26.23 STAMP5_ADC_SG1.22 34.87,26.23 v36.83,28.19 36.83,29.72 37.24,30.13 STAMP5_ADC_SG1.1 38.84,30.16 R100.2 44.01,30.16 46.74,27.43 46.74,24.38 45.97,23.62 | C113.1 42.23,21.4 43.18,22.35 43.69,22.35 44.96,23.62 45.97,23.62 | 45.97,23.62 45.97,23.58 v48.01,21.55 48.47,21.55 68.83,41.91 v72.14,41.91 v74.42,44.2 75.89,45.66 STAMP3_ADC_SG1.22 79.05,45.66 79.5,45.21 79.5,41.4 v78.38,40.28 76.64,38.54 C136.1 | v45.21,31.5 46.74,33.02 v47.24,33.02 | 84.58,49.57 87.22,49.57 R119.2 89.25,51.59 v89.64,51.59 | 84.58,49.57 STAMP3_ADC_SG1.1 | C134.1 82.8,51.34 84.58,49.57 | C199.1 53.85,59.18 52.83,58.17 52.07,58.17 51.98,58.26 STAMP6_ADC_SG1.1 51.98,61.59 51.03,62.53 49.66,62.53 48.98,63.21 | STAMP6_ADC_SG1.22 48.16,64.9 48.16,64.04 48.98,63.21 | 41.91,65.02 41.91,63.5 42.2,63.21 48.98,63.21 | C33.1 44.96,99.06 v45.47,98.55 45.92,98.1 STAMP1_ADC_SG1.22 45.92,96.12 v46.97,95.06 | C45.1 48.96,88.83 49.82,89.7 STAMP1_ADC_SG1.1 49.78,91.27 v49.78,92.71 49.78,93.22 50.55,93.98 50.55,94.18 50.29,94.44 48.31,94.44 47.69,95.06 v46.97,95.06
  Bottom 0.381: v40.13,101.85 38.35,101.85 36.83,103.38 36.83,104.9 v37.59,105.66 37.59,106.93 v38.1,107.44 | v76.96,68.58 76.64,68.9 R4.2 75.18,67.82 74.68,67.31 71.37,67.31 70.36,68.33 70.36,71.63 RCJ2.2 71.63,73.41 | C19.1 70.36,82.3 v70.1,82.04 | v61.55,75.95 63.6,75.95 64.47,76.81 69.49,76.81 70.61,75.69 | 70.61,75.69 70.61,73.91 71.12,73.41 | 70.61,75.69 71.12,76.2 72.14,76.2 73.28,77.34 | 73.41,77.47 73.31,77.57 73.31,79.41 73.41,79.5 73.41,80.26 73.03,80.64 71.5,80.64 v70.1,82.04 | v70.1,82.04 71.12,83.06 v75.18,83.06 72.14,86.11 72.14,88.14 71.88,88.39 70.1,88.39 69.85,88.65 v69.85,90.68 69.85,90.93 71.12,92.2 74.42,92.2 v74.93,92.71 | v59.94,47.5 59.94,50.04 v60.2,50.29 | v46.97,95.06 42.74,95.06 v42.67,95 | v41.91,84.58 41.91,85.02 R28.2 | v80.44,103.71 83.74,103.71 85.85,101.6 85.85,93.47 83.95,91.57 | 83.95,91.57 83.81,91.43 80.27,91.43 v79.76,91.95 | v54.25,49.93 v56.39,52.07 | v56.39,54.49 56.39,55.44 R176.2 | v90.42,76.96 90.17,76.96 89.73,77.4 R71.2 85.85,82.36 85.85,89.66 83.95,91.57 | 103.7,88.58 105.6,88.58 v107.19,90.17 | v83.06,81.14 83.82,80.38 83.82,78.99 85.85,76.96 v90.42,76.96 | v119.63,102.62 119.63,115.06 123.19,118.62 123.19,122.94 82.55,122.94 81.28,121.67 74.42,121.67 v73.91,122.17
  Bottom 0.508: v119.38,62.48 120.52,61.34 137.16,61.34 137.92,60.58 v137.92,59.44
  Bottom 0.635: C28.2 142.31,68.25 TPS78512QKVURQ1.1
  Bottom 0.762: TPS78512QKVURQ1.1 TPS78512QKVURQ1.2 | v64.52,108.2 64.52,111 65.79,112.27 65.79,114.05 63.75,116.08 v61.21,116.08 | v119.13,54.1 118.11,54.1 117.35,53.34 117.35,51.12 118.11,50.36 119.38,50.36 | v109.98,44.2 108.71,42.93 C155.1 | v137.92,59.44 139.06,59.44 139.27,59.23 141.48,59.23
  Bottom 1.016: 141.48,59.23 L2.1 142.58,59.56 144.78,59.56 145.16,59.94 145.16,67.18 | 145.16,67.18 145.16,67.82 | 145.16,67.82 145.16,68.45 145.71,69.01 L1.1 | TPS78512QKVURQ1.1 144.79,68.19 145.16,67.82 | TPS78512QKVURQ1.2 145.03,67.05 145.16,67.18 | C15.1 C19.1 | R3.1 v80.44,103.71 81.66,102.49 R2.1
  Bottom 1.27: C199.1 54.68,57.59 54.86,57.4 56.39,57.4 56.58,57.22 R176.2 | C16.1 C18.1
4V096  (via drill 0.35)
  Top 0.254: 66.03,116.08 66.03,116.13 REF4V096.P4
  Top 0.381: U$16.P$5 88.01,29.66 R149.2 | U$12.P$5 30.35,42.55 R111.2 | U$14.P$5 57.91,29.84 R130.2 | U$20.P$5 R187.2 | U$7.P$5 30.73,121.67 R74.2
  Top 0.508: R54.1 66.03,116.08 | R92.2 U$10.P$5
  Top 0.635: v87.38,24.64 87.38,26.04 U$16.P$5 | v27.94,43.18 29.21,41.91 U$12.P$5 | v55.12,24.64 U$14.P$5 | v27.43,78.74 U$20.P$5 | U$7.P$5 28.45,119.63 v26.92,121.16 26.92,122.17 28.45,123.7 64.01,123.7 | REF4V096.P4 64.52,117.64 64.52,123.19 | U$10.P$5 118.11,105.16 117.86,105.41 v95.5,105.41 | v77.22,117.86 75.44,117.86 69.6,123.7 65.02,123.7 | 64.52,123.19 arc90 64.01,123.7 | 64.52,123.19 arc-90 65.02,123.7 | 64.01,123.7 65.02,123.7
  Bottom 0.381: U$15.P$5 R143.2 | R105.2 29.21,13.53 U$11.P$5 | U$13.P$5 R124.2 | U$19.P$5 R181.2 | U$6.P$5 26.67,92.46 26.67,89.41 27.69,88.39 R33.2
  Bottom 0.508: 95.5,103.89 U$9.P$5 95.38,101.15 R86.2
  Bottom 0.635: U$15.P$5 116.59,24.38 116.59,13.72 112.27,9.4 89.66,9.4 | 85.6,24.13 85.6,13.46 89.66,9.4 | U$11.P$5 27.18,13.46 24.64,13.46 arc90 23.62,12.45 23.62,10.67 | 23.62,9.91 23.5,9.78 25.4,7.87 43.18,7.87 44.7,9.4 49.78,9.4 | 23.62,9.91 22.86,9.91 | 22.86,9.91 12.95,9.91 11.18,11.68 11.18,40.89 11.18,42.42 | v87.38,24.64 86.11,24.64 | 86.11,24.64 85.6,24.64 | 85.6,24.64 85.09,24.64 | 85.09,24.64 83.31,24.64 U$13.P$5 | 89.66,9.4 49.78,9.4 | 49.78,9.4 48.77,10.41 48.77,14.99 53.09,19.3 53.09,22.61 v55.12,24.64 | U$19.P$5 27.94,53.09 v27.94,43.18 13.46,43.18 12.45,43.18 11.94,43.18 | 11.18,42.42 11.18,43.18 | 11.18,43.18 11.18,43.94 | 11.18,43.94 11.18,78.23 | 11.18,78.23 14.22,81.28 | 14.22,81.28 24.89,81.28 v27.43,78.74 | 14.22,81.28 27.43,94.49 U$6.P$5 | 11.18,78.23 11.18,119.13 13.72,121.67 26.42,121.67 v26.92,121.16 | 95.5,103.89 v95.5,105.41 95.5,108.97 95.25,109.22 93.73,109.22 92.71,110.24 92.71,117.6 92.46,117.86 v77.22,117.86 | 85.6,24.64 85.6,24.13 | 85.6,24.13 arc90 85.09,24.64 | 85.6,24.13 arc-90 86.11,24.64 | 23.62,9.91 23.62,10.67 | 23.62,10.67 arc-90 22.86,9.91 | 11.94,43.18 11.18,43.18 | 11.94,43.18 arc90 11.18,42.42 | 11.94,43.18 arc-90 11.18,43.94
5V  (via drill 0.35)
  Top 0.635: 138.94,67.28 135.54,67.28 132.08,70.74 129.03,70.74 129.03,77.47 127.76,78.74 124.9,78.74 R20.1
  Top 0.762: R20.1 R49.1
  Top 1.016: U_LT1528.5 138.94,67.28 139.54,67.28 139.83,66.99 | 139.83,66.99 141.38,65.44 | 141.38,65.44 C36.2 144.66,64.58 C40.+ | U_LT1528.4 139.83,65.58 | 139.83,65.33 141.27,65.33 141.38,65.44 | 139.83,66.99 139.83,65.58 | 139.83,65.58 139.83,65.33 | 139.83,65.33 139.83,64.49 139.88,64.44 139.88,55.04 137.67,52.83 124.97,52.83 123.95,51.82 123.95,47.88 125.86,45.97 125.86,35.69 U_TRACODCDC.3 121.28,31.11 | R48.1 106.25,53.72 106.78,53.19 | 106.78,53.19 113.78,46.19 113.78,31.75 114.41,31.11 121.28,31.11 | 106.78,53.19 105.16,51.56 101.6,51.56 99.31,53.85 99.31,56.39 97.5,58.2 R47.1 95.88,60.71 94.49,60.71 93.72,61.47 93.72,61.73 v92.2,63.25 | 121.28,31.11 120.65,30.48 120.65,9.4 119.13,7.87 84.84,7.87 82.04,10.67 77.47,10.67 74.42,7.62 15.24,7.62 10.92,11.94 v10.92,121.92 | v70.61,119.38 70.61,116.91 R54.2
  Bottom 1.016: R52.1 R19.1 R18.1 92.96,64.01 v92.2,63.25 | v10.92,121.92 12.7,123.7 66.8,123.7 70.61,119.89 v70.61,119.38
  Bottom 1.524: C64.+ 124.46,37.27 U_TRACODCDC.3 125.41,34.29 C35.2 132.19,37.15 C39.+ C66.+ C65.+
5V-NONISO  (via drill 0.4)
  Top 0.635: R16.1 144.88,96.11 143.76,95 v142.37,95 139.83,95 138.81,93.98 | C43.1 144.72,79.44 v143,77.72 U_7805.1 | R25.2 136.21,96.58 138.81,93.98 | 138.81,93.98 U_MAX488.1
  Route15 0.635: v143,77.72 142.37,78.36 v142.37,95
28V  (via drill 0.35, 0.4, 0.6)
  Top 0.635: U_7805.8 143,69.85 | C42.2 v144.53,69.85 143,69.85 | 143,69.85 142.75,69.6 138.05,69.6 138.05,74.55 137.86,74.74 R13.1
  Top 1.27: R12.1 144.02,83.69 v146.69,86.36 | R13.1 136.4,76.71 | 136.4,76.71 138.05,78.36 140.84,78.36 142.17,79.69 R11.1 | v135.13,77.98 136.4,76.71
  Top 1.778: X1.1 153.67,85.65 X1.9
  Route2 1.778: X1.1 144.78,79.3 144.78,75.95 | 144.78,75.95 U_TRACODCDC.1 | 144.78,75.95 137.16,75.95 v135.13,77.98
  Bottom 1.27: v146.69,86.36 150.42,86.36 X1.1
  Bottom 2.54: U_TRACODCDC.1 143.94,27.5 C38.+ C61.+ 130.88,27.5 128.65,25.27 128.65,13.46 131.52,10.6 C60.+ C62.+
28VGND  (via drill 0.25, 0.6)
  Top 0.635: U_OPTO_4.7 130.68,89.79 130.18,89.28 130.18,87.76 130.68,87.25 U_OPTO_4.5 133.99,87.25 134.75,86.49 134.75,85.72 | U_7805.6 140.46,72.64 141.6,72.64 | 141.6,72.64 141.73,72.52 | 141.73,72.52 141.73,71.63 U_7805.7 | 141.6,72.64 141.86,72.64 | C42.1 144.4,75.19 143,73.79 | 143,73.79 141.86,72.64 | U_7805.3 140.46,74.93 141.73,74.93 | 141.73,74.93 U_7805.2 | 141.73,74.93 141.86,74.93 143,73.79 | U_MAX488.4 142.62,89.79 144.02,89.79 145.92,91.69 v145.92,94.36 | 141.86,72.64 141.73,72.52
  Top 1.016: R23.2 128.97,82.87 129.41,83.31 129.41,85.22 129.92,85.72 134.75,85.72 140.84,85.72 v141.48,86.36
  Top 1.27: C43.2 147.07,80.39 v147.07,78.11 C42.1
  Route2 1.778: X1.8 149.56,104.85 145.92,101.22 v145.92,94.36
  Bottom 1.016: v141.48,86.36 D5.A
  Bottom 1.27: R17.1 C44.2 149.62,106.36 arc-90 X1.8
  Bottom 1.778: X1.15 153.67,104.85 X1.8 | v145.92,94.36 143.89,92.33 D1.A D5.A 143.89,81.28 v147.07,78.11 147.07,75.31 151.26,71.12 151.26,28.07 U_TRACODCDC.2
  Bottom 3.302: C38.- C61.- C60.- C62.- C38.- | C38.- 140.53,21.59 U_TRACODCDC.2
ADC_START  (via drill 0.35)
  Top 0.254: U$3.P13 48.23,50.06
  Top 0.381: v104.39,80.52 108.34,80.52 STAMP2_ADC_SG2.23 109.94,80.56 110.49,80.01 110.49,76.45 108.2,74.17 v108.2,72.14 | STAMP2_ADC_TEMP.23 102.32,82.51 v102.36,82.55 | STAMP4_ADC_TEMP.23 104.43,36.58 103.27,36.58 v101.17,38.68 | v95.5,48.26 95.42,48.35 STAMP4_ADC_SG2.23 | v41.66,26.67 41.66,24.58 42.14,24.09 STAMP5_ADC_TEMP.23 | STAMP5_ADC_SG2.23 49.23,39.81 50.57,41.15 v50.8,41.15 | STAMP3_ADC_SG2.23 67.53,46.94 69.04,46.94 v69.09,46.99 | STAMP3_ADC_TEMP.23 84.54,39.84 85.09,40.39 85.09,43.94 84.07,44.96 81.79,44.96 80.77,45.97 v80.77,46.23 | v39.37,61.72 38.31,60.66 STAMP6_ADC_TEMP.23 38.31,56.17 41.66,52.83 | STAMP6_ADC_SG2.23 48.6,70.7 v46.48,68.58 | v45.59,107.67 45.57,107.7 45.57,110.1 45.55,110.08 STAMP1_ADC_SG2.23 | STAMP1_ADC_TEMP.23 41.94,102.53 42.8,102.53 43.4,103.12 v46.31,103.12 | 41.66,52.83 45.47,52.83 48.23,50.06 | 41.66,52.83 41.91,52.58 v41.91,48.01
  Route2 0.381: v102.36,82.55 v104.39,80.52 | v101.17,38.68 95.5,44.35 v95.5,48.26 | v95.5,48.26 103.38,56.13 v108.2,56.13 | 48.26,41.15 v50.8,41.15 63.25,41.15 v69.09,46.99 80.01,46.99 v80.77,46.23 93.47,46.23 v95.5,48.26 | 48.26,41.15 41.66,34.54 v41.66,26.67 37.34,30.99 v36.83,30.99 | v39.37,61.72 46.23,68.58 v46.48,68.58 45.21,69.85 45.21,78.74 46.06,79.59 46.06,98.3 v46.57,98.81 | v41.91,48.01 48.26,41.66 48.26,41.15
  Route15 0.381: v108.2,72.14 v108.2,56.13
  Bottom 0.381: v104.39,80.52 100.7,80.52 STAMP2_ADC_SG1.23 | STAMP4_ADC_SG1.23 113.37,49.44 113.28,49.53 113.28,54.1 111.25,56.13 v108.2,56.13 | STAMP5_ADC_SG1.23 34.25,26.88 34.8,27.43 34.8,28.96 v36.83,30.99 | STAMP3_ADC_SG1.23 80.69,46.31 v80.77,46.23 | STAMP6_ADC_SG1.23 48.73,67.27 47.42,68.58 v46.48,68.58 | STAMP1_ADC_SG1.23 v46.57,98.81 46.31,99.06 v46.31,103.12 46.31,106.19 45.85,106.66 45.85,107.42 v45.59,107.67
ADC_START_1V2  (via drill 0.35)
  Top 0.254: U$3.P8 48.23,55.57 48.07,55.74 v48.07,56.26 | v65.91,97.41 65.96,97.46 SF2_M2S010TQ1.128
  Route15 0.254: v48.07,56.26 48.07,76.74 65.91,94.58 v65.91,97.41
DAPI_CTS  (via drill 0.35)
  Top 0.254: U$2.P14 73.29,108.46 73.21,108.53 v73.21,109.35 | USB.40 120.33,111.32 arc-90 119.76,111.89 119.76,119.83 arc-90 v120.14,120.21
  Bottom 0.254: v73.21,109.35 73.21,116.2 arc-90 77.22,120.21 v120.14,120.21
DAPI_DSR  (via drill 0.35)
  Top 0.254: USB.43 120.24,109.82 arc90 118.88,108.46 118.88,108.08 arc-90 118.11,107.31 118,107.43 v93.34,107.43 | U$2.P16 71.99,106.57 72.26,106.3 75.87,106.3 77,107.43 v77.09,107.43
  Bottom 0.254: v93.34,107.43 v77.09,107.43
DAPI_DTR  (via drill 0.35)
  Top 0.254: USB.44 120.24,109.32 arc90 119.38,108.46 119.38,108.08 arc-90 118.11,106.81 118,106.7 v93.34,106.7 | U$2.P17 71.34,106.21 71.75,105.79 76.18,105.79 v77.09,106.7
  Bottom 0.254: v93.34,106.7 v77.09,106.7
DAPI_RTS  (via drill 0.35)
  Top 0.254: U$2.P15 72.64,108.46 72.48,108.61 v72.48,109.35 | USB.41 120.32,110.82 arc-90 119.25,111.89 119.25,120.02 arc90 118.36,120.9 116.87,120.9 arc-90 v116.84,120.94
  Bottom 0.254: v72.48,109.35 72.48,116.2 arc-90 77.22,120.94 v116.84,120.94
DAPI_RXD  (via drill 0.35)
  Top 0.254: U$2.P12 74.59,108.46 74.68,108.54 v74.68,109.35 | USB.38 120.86,112.32 arc-90 120.78,112.39 120.78,118.36 arc-90 121.16,118.75 v121.67,118.75
  Bottom 0.254: v74.68,109.35 74.68,116.2 arc-90 77.22,118.75 v121.67,118.75
DAPI_TXD  (via drill 0.35)
  Top 0.254: v73.94,109.35 73.94,109.29 73.94,109.28 U$2.P13 | USB.39 120.47,111.82 arc-90 120.27,112.01 120.27,119.25 arc-90 120.52,119.51 121.38,119.51 arc-90 v121.41,119.48
  Bottom 0.254: v73.94,109.35 73.94,116.2 arc-90 77.22,119.48 v121.41,119.48
EECLK
  Top 0.254: USB.62 130.69,100.01 FT_EEPROM.2
EECS
  Top 0.254: FT_EEPROM.1 131.41,103.79 131.19,104.01 USB.63
EED
  Top 0.254: 130.11,100.46 130.11,103.89 130.19,103.97 USB.61 | 130.11,100.46 FT_EEPROM.3 | R24.2 129.16,101.41 130.11,100.46
EXP_IN  (via drill 0.25, 0.4)